# EAGLE design uClouds_SE_Main_Board (EAGLE 9.5.2)

## Sheet 1 of 5
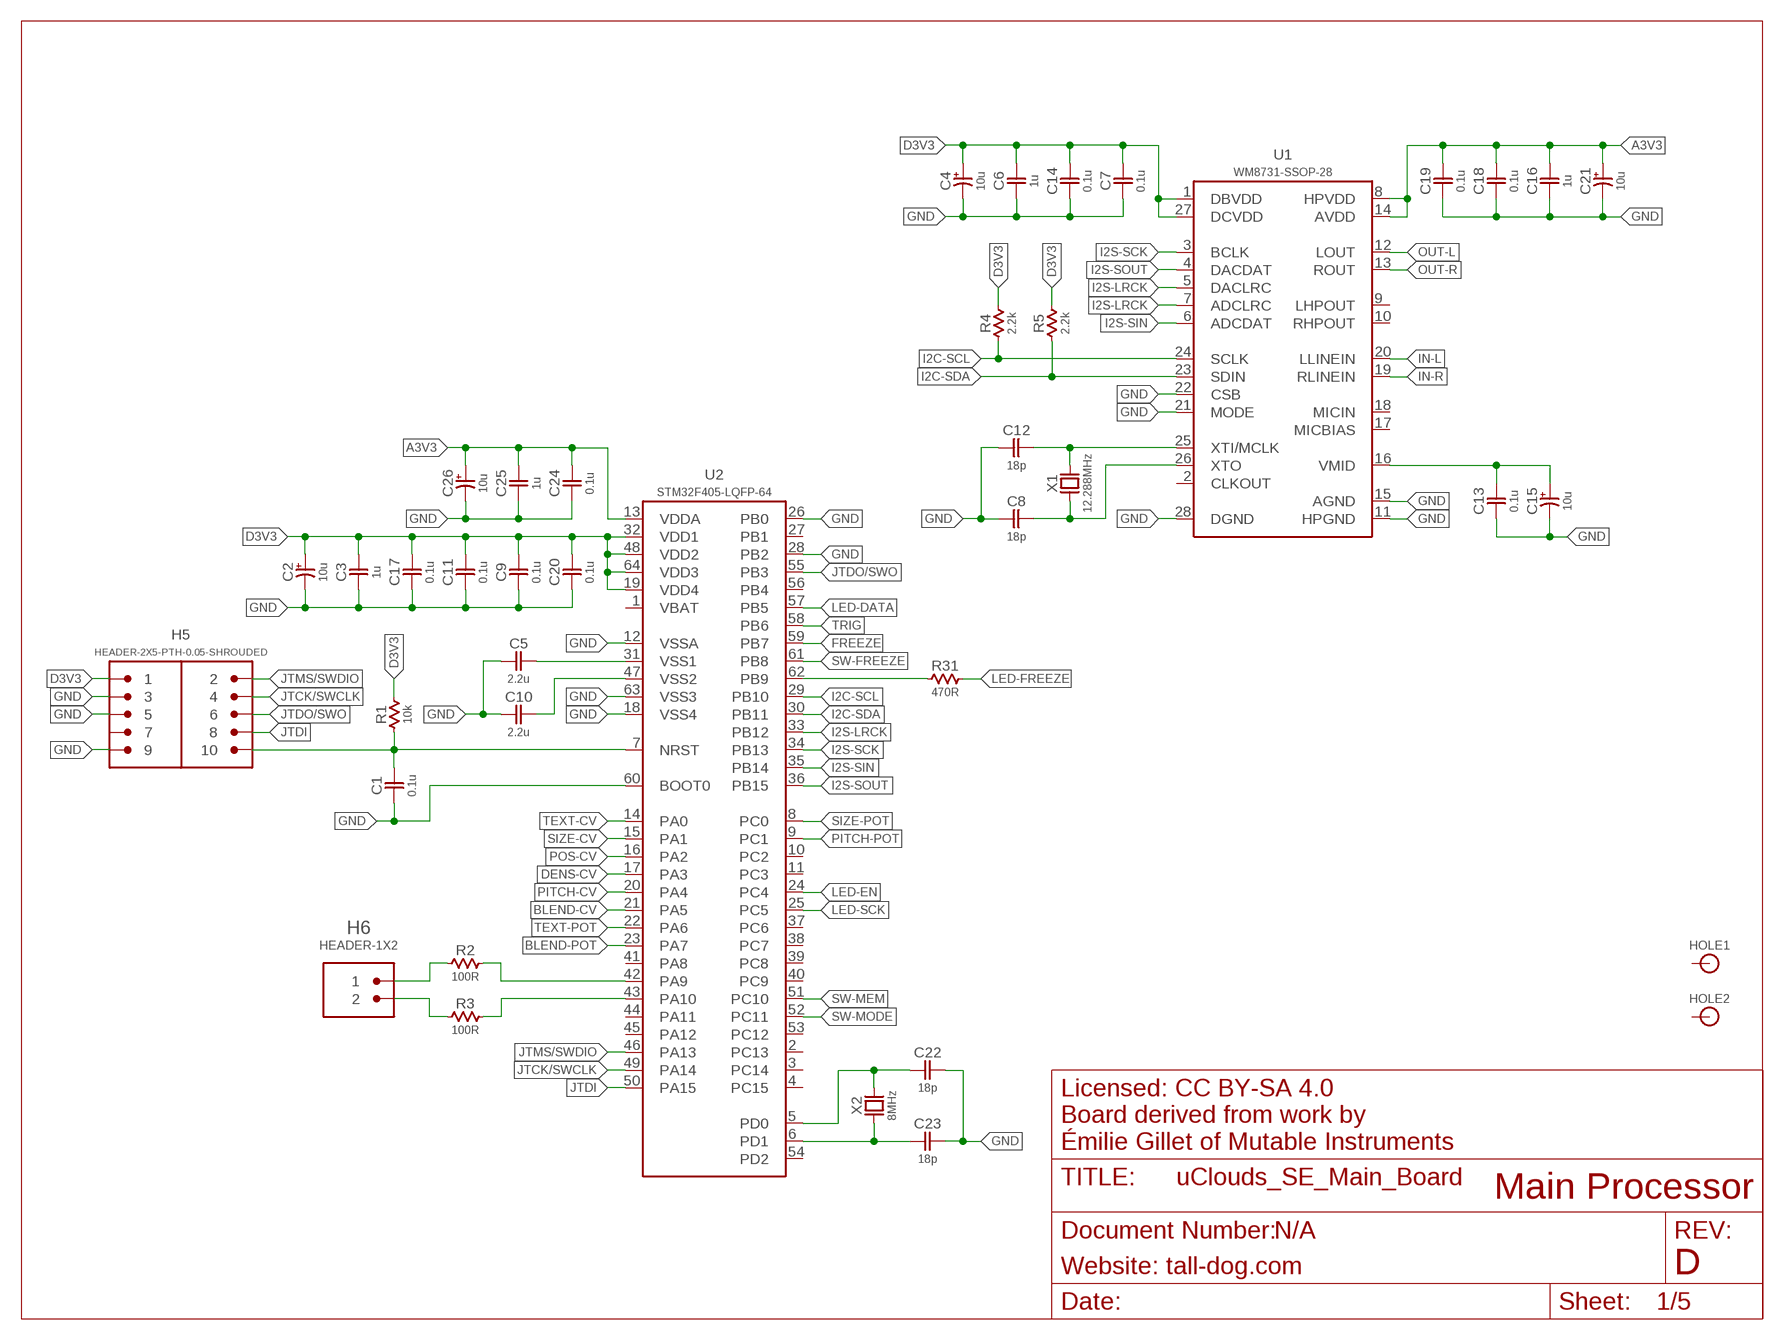
[diagram p0: schematic, sheet 1]

### Parts
C1  0.1u  CAP-NP-0603  [0603-NP]
C2  10u  CAP-P-4.3MM  [ELECTRO-SMD-4.3MM]
C3  1u  CAP-NP-0603  [0603-NP]
C4  10u  CAP-P-4.3MM  [ELECTRO-SMD-4.3MM]
C5  2.2u  CAP-NP-0603  [0603-NP]
C6  1u  CAP-NP-0603  [0603-NP]
C7  0.1u  CAP-NP-0603  [0603-NP]
C8  18p  CAP-NP-0603  [0603-NP]
C9  0.1u  CAP-NP-0603  [0603-NP]
C10  2.2u  CAP-NP-0603  [0603-NP]
C11  0.1u  CAP-NP-0603  [0603-NP]
C12  18p  CAP-NP-0603  [0603-NP]
C13  0.1u  CAP-NP-0603  [0603-NP]
C14  0.1u  CAP-NP-0603  [0603-NP]
C15  10u  CAP-P-4.3MM  [ELECTRO-SMD-4.3MM]
C16  1u  CAP-NP-0603  [0603-NP]
C17  0.1u  CAP-NP-0603  [0603-NP]
C18  0.1u  CAP-NP-0603  [0603-NP]
C19  0.1u  CAP-NP-0603  [0603-NP]
C20  0.1u  CAP-NP-0603  [0603-NP]
C21  10u  CAP-P-4.3MM  [ELECTRO-SMD-4.3MM]
C22  18p  CAP-NP-0603  [0603-NP]
C23  18p  CAP-NP-0603  [0603-NP]
C24  0.1u  CAP-NP-0603  [0603-NP]
C25  1u  CAP-NP-0603  [0603-NP]
C26  10u  CAP-P-4.3MM  [ELECTRO-SMD-4.3MM]
H5  HEADER-2X5-PTH-0.05-SHROUDED  [PTH-0.05-2X5-SHROUDED]
H6  HEADER-1X2  [PTH-0.1-1X2]
HOLE1  HOLE  [M2.5-HOLE]
HOLE2  HOLE  [M2.5-HOLE]
R1  10k  RESISTOR-0603  [0603-NP]
R2  100R  RESISTOR-0603  [0603-NP]
R3  100R  RESISTOR-0603  [0603-NP]
R4  2.2k  RESISTOR-0603  [0603-NP]
R5  2.2k  RESISTOR-0603  [0603-NP]
R31  470R  RESISTOR-0603  [0603-NP]
U1  WM8731-SSOP-28  [SSOP-28]
U2  STM32F405-LQFP-64  [LQFP-64]
X1  12.288MHz  CRYSTAL-ABM3  [CRYSTAL-ABM3]
X2  8MHz  CRYSTAL-ABM3  [CRYSTAL-ABM3]

### Nets
A3V3: C16.2 C18.2 C19.2 C21.A(POS) C24.2 C25.2 C26.A(POS) U1.8(HPVDD) U1.14(AVDD) U2.13(VDDA) ; also sheet 2,4,5
BLEND-CV: U2.21(PA5) ; also sheet 4
BLEND-POT: U2.23(PA7) ; also sheet 2
D3V3: C2.A(POS) C3.2 C4.A(POS) C6.2 C7.2 C9.2 C11.2 C14.2 C17.2 C20.2 H5.1 R1.2 R4.2 R5.2 U1.1(DBVDD) U1.27(DCVDD) U2.19(VDD4) U2.32(VDD1) U2.48(VDD2) U2.64(VDD3) ; also sheet 2,5
DENS-CV: U2.17(PA3) ; also sheet 4
FREEZE: U2.59(PB7) ; also sheet 2
GND: C1.1 C2.C(NEG) C3.1 C4.C(NEG) C5.1 C6.1 C7.1 C8.1 C9.1 C10.1 C11.1 C12.1 C13.1 C14.1 C15.C(NEG) C16.1 C17.1 C18.1 C19.1 C20.1 C21.C(NEG) C22.2 C23.2 C24.1 C25.1 C26.C(NEG) H5.3 H5.5 H5.9 U1.11(HPGND) U1.15(AGND) U1.21(MODE) U1.22(CSB) U1.28(DGND) U2.12(VSSA) U2.18(VSS4) U2.26(PB0) U2.28(PB2) U2.60(BOOT0) U2.63(VSS3) ; also sheet 2,3,4,5
I2C-SCL: R4.1 U1.24(SCLK) U2.29(PB10)
I2C-SDA: R5.1 U1.23(SDIN) U2.30(PB11)
I2S-LRCK: U1.5(DACLRC) U1.7(ADCLRC) U2.33(PB12)
I2S-SCK: U1.3(BCLK) U2.34(PB13)
I2S-SIN: U1.6(ADCDAT) U2.35(PB14)
I2S-SOUT: U1.4(DACDAT) U2.36(PB15)
IN-L: U1.20(LLINEIN) ; also sheet 3
IN-R: U1.19(RLINEIN) ; also sheet 3
JTCK/SWCLK: H5.4 U2.49(PA14)
JTDI: H5.8 U2.50(PA15)
JTDO/SWO: H5.6 U2.55(PB3)
JTMS/SWDIO: H5.2 U2.46(PA13)
LED-DATA: U2.57(PB5) ; also sheet 2
LED-EN: U2.24(PC4) ; also sheet 2
LED-FREEZE: R31.2 ; also sheet 2
LED-SCK: U2.25(PC5) ; also sheet 2
N$7: C5.2 U2.31(VSS1)
N$8: C10.2 U2.47(VSS2)
N$11: C22.1 U2.5(PD0) X2.2
N$12: C23.1 U2.6(PD1) X2.1
N$22: C12.2 U1.25(XTI/MCLK) X1.2
N$23: C8.2 U1.26(XTO) X1.1
N$27: C13.2 C15.A(POS) U1.16(VMID)
N$37: R31.1 U2.62(PB9)
OUT-L: U1.12(LOUT) ; also sheet 3
OUT-R: U1.13(ROUT) ; also sheet 3
PITCH-CV: U2.20(PA4) ; also sheet 4
PITCH-POT: U2.9(PC1) ; also sheet 2
POS-CV: U2.16(PA2) ; also sheet 4
RESET: C1.2 H5.10 R1.1 U2.7(NRST)
RX: H6.2 R3.1
RX1: R3.2 U2.43(PA10)
SIZE-CV: U2.15(PA1) ; also sheet 4
SIZE-POT: U2.8(PC0) ; also sheet 2
SW-FREEZE: U2.61(PB8) ; also sheet 2
SW-MEM: U2.51(PC10) ; also sheet 2
SW-MODE: U2.52(PC11) ; also sheet 2
TEXT-CV: U2.14(PA0) ; also sheet 4
TEXT-POT: U2.22(PA6) ; also sheet 2
TRIG: U2.58(PB6) ; also sheet 2
TX: H6.1 R2.1
TX1: R2.2 U2.42(PA9)
Unconnected: H5.7 HOLE1.P$1 HOLE1.P$2 HOLE1.P$3 HOLE1.P$4 HOLE1.P$5 HOLE1.P$6 HOLE1.P$7 HOLE1.P$8 HOLE1.P$9 HOLE2.P$1 HOLE2.P$2 HOLE2.P$3 HOLE2.P$4 HOLE2.P$5 HOLE2.P$6 HOLE2.P$7 HOLE2.P$8 HOLE2.P$9 U1.2(CLKOUT) U1.9(LHPOUT) U1.10(RHPOUT) U1.17(MICBIAS) U1.18(MICIN) U2.1(VBAT) U2.2(PC13) U2.3(PC14) U2.4(PC15) U2.10(PC2) U2.11(PC3) U2.27(PB1) U2.37(PC6) U2.38(PC7) U2.39(PC8) U2.40(PC9) U2.41(PA8) U2.44(PA11) U2.45(PA12) U2.53(PC12) U2.54(PD2) U2.56(PB4)

### Notes on the sheet
- Licensed: CC BY-SA 4.0
  Board derived from work by
  Émilie Gillet of Mutable Instruments
- Main Processor
- N/A
- Website: tall-dog.com | D

## Sheet 2 of 5
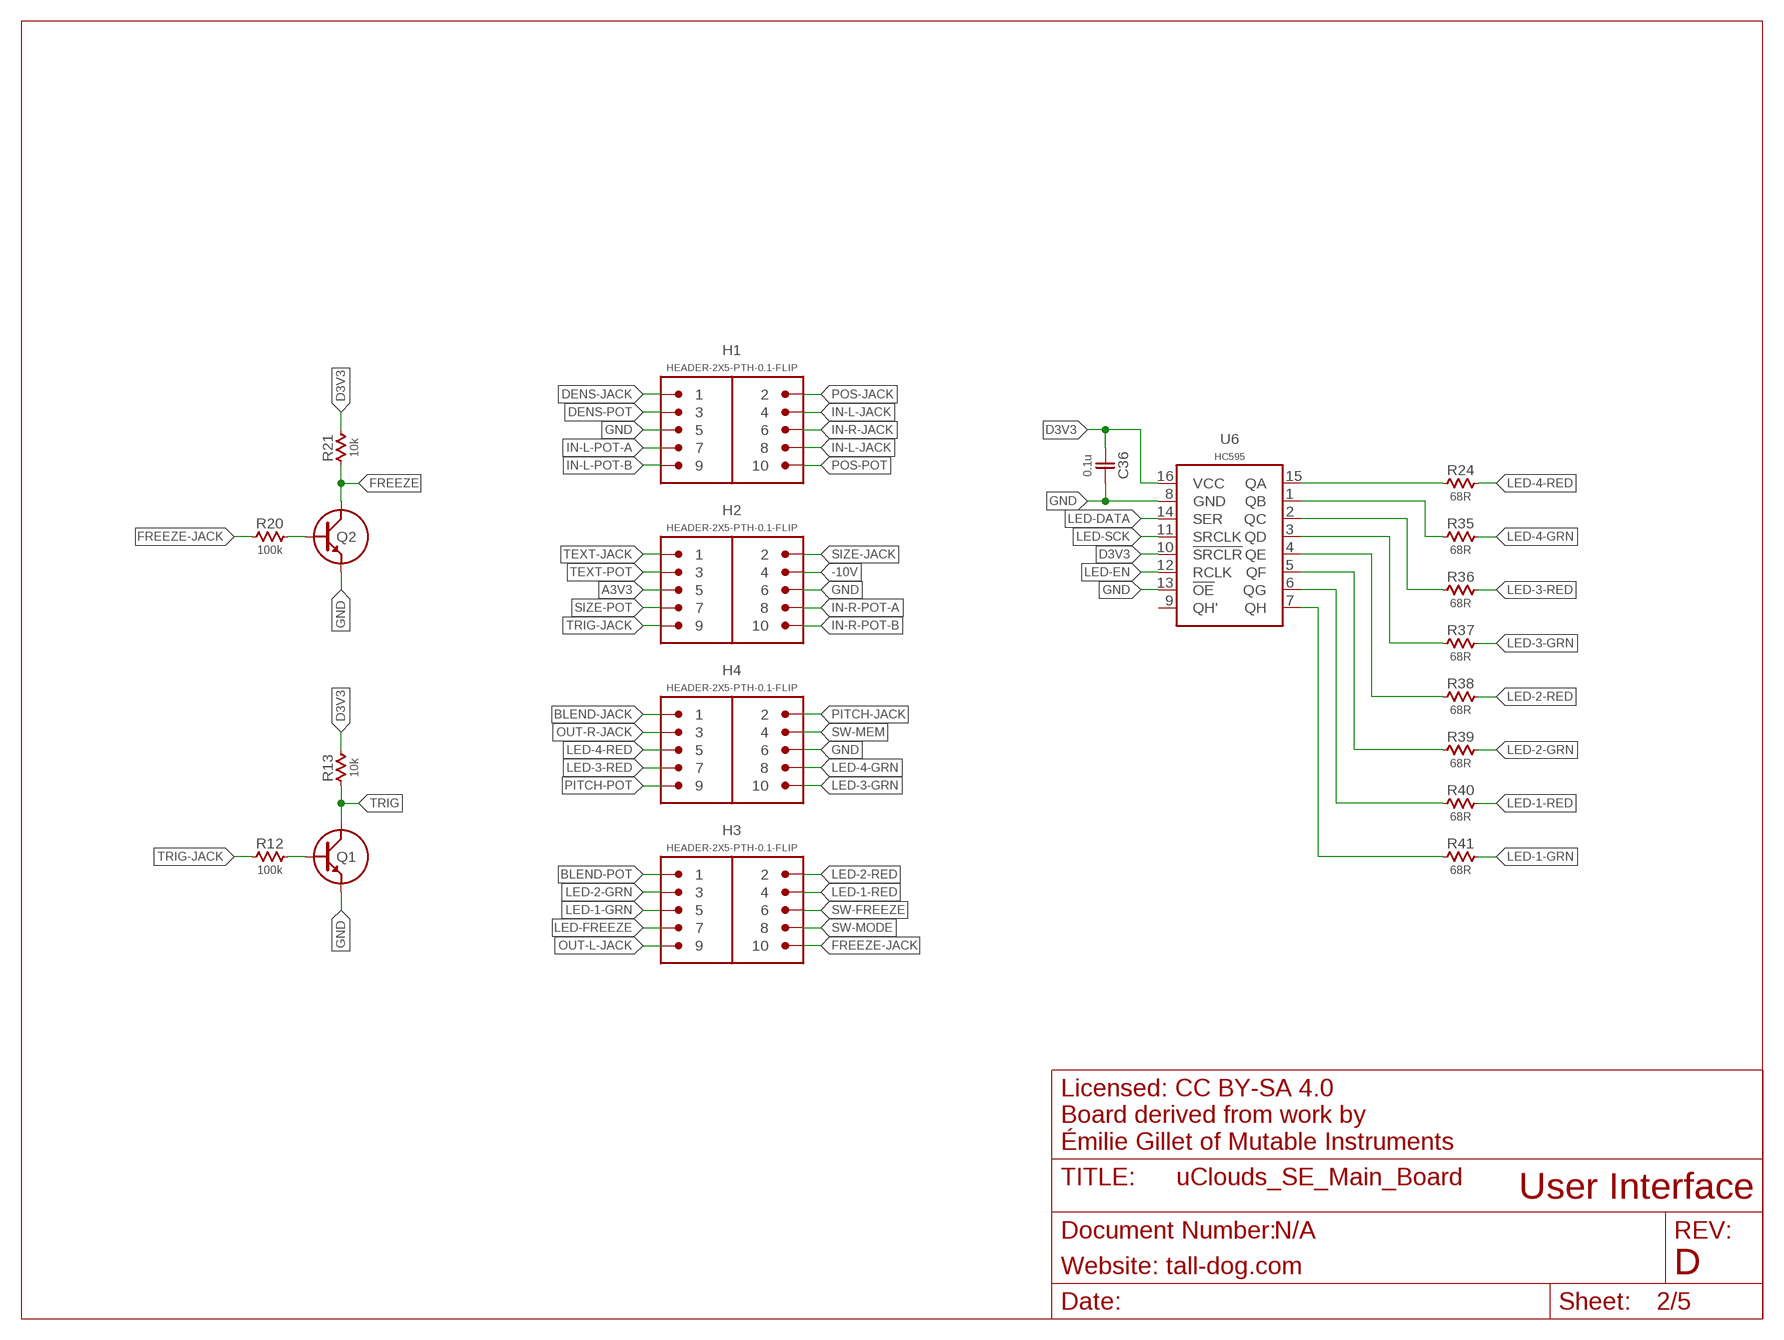
[diagram p1: schematic, sheet 2]

### Parts
C36  0.1u  CAP-NP-0603  [0603-NP]
H1  HEADER-2X5-PTH-0.1-FLIP  [PTH-0.1-2X5-FEMALE]
H2  HEADER-2X5-PTH-0.1-FLIP  [PTH-0.1-2X5-FEMALE]
H3  HEADER-2X5-PTH-0.1-FLIP  [PTH-0.1-2X5-FEMALE]
H4  HEADER-2X5-PTH-0.1-FLIP  [PTH-0.1-2X5-FEMALE]
Q1  NPN-SOT23-BEC  [SOT-23]
Q2  NPN-SOT23-BEC  [SOT-23]
R12  100k  RESISTOR-0603  [0603-NP]
R13  10k  RESISTOR-0603  [0603-NP]
R20  100k  RESISTOR-0603  [0603-NP]
R21  10k  RESISTOR-0603  [0603-NP]
R24  68R  RESISTOR-0603  [0603-NP]
R35  68R  RESISTOR-0603  [0603-NP]
R36  68R  RESISTOR-0603  [0603-NP]
R37  68R  RESISTOR-0603  [0603-NP]
R38  68R  RESISTOR-0603  [0603-NP]
R39  68R  RESISTOR-0603  [0603-NP]
R40  68R  RESISTOR-0603  [0603-NP]
R41  68R  RESISTOR-0603  [0603-NP]
U6  HC595  [TSSOP-16]

### Nets
-10V: H2.4 ; also sheet 4,5
A3V3: H2.5 ; also sheet 1,4,5
BLEND-JACK: H4.1 ; also sheet 4
BLEND-POT: H3.1 ; also sheet 1
D3V3: C36.2 R13.2 R21.2 U6.10(!SRCLR) U6.16(VCC) ; also sheet 1,5
DENS-JACK: H1.1 ; also sheet 4
DENS-POT: H1.3 ; also sheet 4
FREEZE: Q2.3(C) R21.1 ; also sheet 1
FREEZE-JACK: H3.10 R20.1
GND: C36.1 H1.5 H2.6 H4.6 Q1.2(E) Q2.2(E) U6.8(GND) U6.13(!OE) ; also sheet 1,3,4,5
IN-L-JACK: H1.4 H1.8 ; also sheet 3
IN-L-POT-A: H1.7 ; also sheet 3
IN-L-POT-B: H1.9 ; also sheet 3
IN-R-JACK: H1.6 ; also sheet 3
IN-R-POT-A: H2.8 ; also sheet 3
IN-R-POT-B: H2.10 ; also sheet 3
LED-1-GRN: H3.5 R41.2
LED-1-RED: H3.4 R40.2
LED-2-GRN: H3.3 R39.2
LED-2-RED: H3.2 R38.2
LED-3-GRN: H4.10 R37.2
LED-3-RED: H4.7 R36.2
LED-4-GRN: H4.8 R35.2
LED-4-RED: H4.5 R24.2
LED-DATA: U6.14(SER) ; also sheet 1
LED-EN: U6.12(RCLK) ; also sheet 1
LED-FREEZE: H3.7 ; also sheet 1
LED-SCK: U6.11(SRCLK) ; also sheet 1
N$1: R24.1 U6.15(QA)
N$6: R35.1 U6.1(QB)
N$9: R36.1 U6.2(QC)
N$10: Q1.1(B) R12.2
N$21: Q2.1(B) R20.2
N$28: R37.1 U6.3(QD)
N$30: R38.1 U6.4(QE)
N$31: R39.1 U6.5(QF)
N$32: R40.1 U6.6(QG)
N$33: R41.1 U6.7(QH)
OUT-L-JACK: H3.9 ; also sheet 3
OUT-R-JACK: H4.3 ; also sheet 3
PITCH-JACK: H4.2 ; also sheet 4
PITCH-POT: H4.9 ; also sheet 1
POS-JACK: H1.2 ; also sheet 4
POS-POT: H1.10 ; also sheet 4
SIZE-JACK: H2.2 ; also sheet 4
SIZE-POT: H2.7 ; also sheet 1
SW-FREEZE: H3.6 ; also sheet 1
SW-MEM: H4.4 ; also sheet 1
SW-MODE: H3.8 ; also sheet 1
TEXT-JACK: H2.1 ; also sheet 4
TEXT-POT: H2.3 ; also sheet 1
TRIG: Q1.3(C) R13.1 ; also sheet 1
TRIG-JACK: H2.9 R12.1
Unconnected: U6.9(QH')

### Notes on the sheet
- Licensed: CC BY-SA 4.0
  Board derived from work by
  Émilie Gillet of Mutable Instruments
- User Interface
- N/A
- Website: tall-dog.com | D

## Sheet 3 of 5
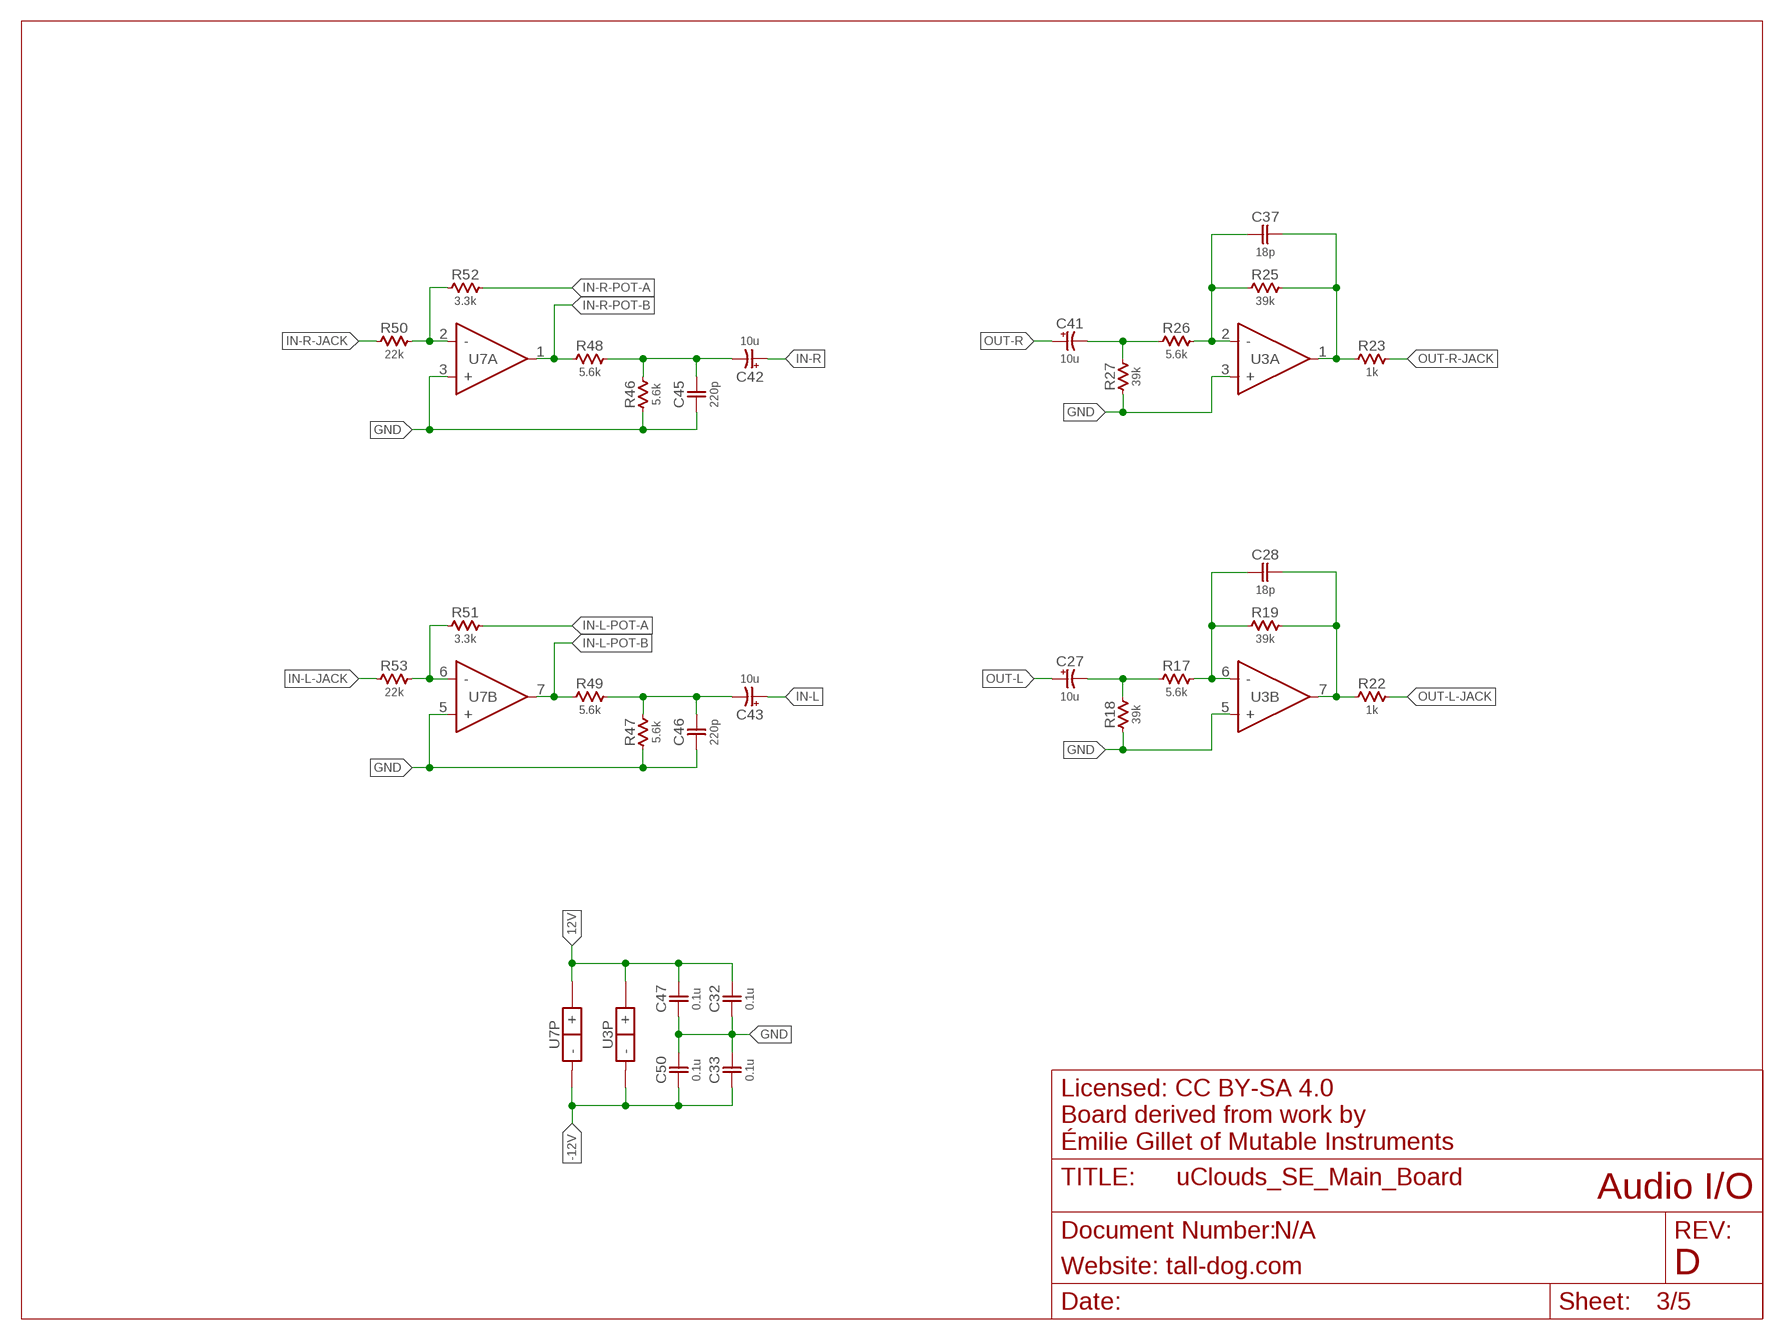
[diagram p2: schematic, sheet 3]

### Parts
C27  10u  CAP-P-4.3MM  [ELECTRO-SMD-4.3MM]
C28  18p  CAP-NP-0603  [0603-NP]
C32  0.1u  CAP-NP-0603  [0603-NP]
C33  0.1u  CAP-NP-0603  [0603-NP]
C37  18p  CAP-NP-0603  [0603-NP]
C41  10u  CAP-P-4.3MM  [ELECTRO-SMD-4.3MM]
C42  10u  CAP-P-4.3MM  [ELECTRO-SMD-4.3MM]
C43  10u  CAP-P-4.3MM  [ELECTRO-SMD-4.3MM]
C45  220p  CAP-NP-0603  [0603-NP]
C46  220p  CAP-NP-0603  [0603-NP]
C47  0.1u  CAP-NP-0603  [0603-NP]
C50  0.1u  CAP-NP-0603  [0603-NP]
R17  5.6k  RESISTOR-0603  [0603-NP]
R18  39k  RESISTOR-0603  [0603-NP]
R19  39k  RESISTOR-0603  [0603-NP]
R22  1k  RESISTOR-0603  [0603-NP]
R23  1k  RESISTOR-0603  [0603-NP]
R25  39k  RESISTOR-0603  [0603-NP]
R26  5.6k  RESISTOR-0603  [0603-NP]
R27  39k  RESISTOR-0603  [0603-NP]
R46  5.6k  RESISTOR-0603  [0603-NP]
R47  5.6k  RESISTOR-0603  [0603-NP]
R48  5.6k  RESISTOR-0603  [0603-NP]
R49  5.6k  RESISTOR-0603  [0603-NP]
R50  22k  RESISTOR-0603  [0603-NP]
R51  3.3k  RESISTOR-0603  [0603-NP]
R52  3.3k  RESISTOR-0603  [0603-NP]
R53  22k  RESISTOR-0603  [0603-NP]
U3  TL072-TSSOP-8  [TSSOP-8]
U7  TL072-TSSOP-8  [TSSOP-8]

### Nets
12V: C32.2 C47.2 U3.8(P:+) U7.8(P:+) ; also sheet 5
-12V: C33.1 C50.1 U3.4(P:-) U7.4(P:-) ; also sheet 5
GND: C32.1 C33.2 C45.1 C46.1 C47.1 C50.2 R18.1 R27.1 R46.1 R47.1 U3.3(A:+) U3.5(B:+) U7.3(A:+) U7.5(B:+) ; also sheet 1,2,4,5
IN-L: C43.A(POS) ; also sheet 1
IN-L-JACK: R53.1 ; also sheet 2
IN-L-POT-A: R51.2 ; also sheet 2
IN-L-POT-B: R49.1 U7.7(B:OUT) ; also sheet 2
IN-R: C42.A(POS) ; also sheet 1
IN-R-JACK: R50.1 ; also sheet 2
IN-R-POT-A: R52.2 ; also sheet 2
IN-R-POT-B: R48.1 U7.1(A:OUT) ; also sheet 2
N$3: R50.2 R52.1 U7.2(A:-)
N$4: R51.1 R53.2 U7.6(B:-)
N$18: C27.C(NEG) R17.1 R18.2
N$19: C43.C(NEG) C46.2 R47.2 R49.2
N$20: C41.C(NEG) R26.1 R27.2
N$24: C28.1 R17.2 R19.1 U3.6(B:-)
N$25: C28.2 R19.2 R22.1 U3.7(B:OUT)
N$26: C37.1 R25.1 R26.2 U3.2(A:-)
N$29: C37.2 R23.1 R25.2 U3.1(A:OUT)
N$35: C42.C(NEG) C45.2 R46.2 R48.2
OUT-L: C27.A(POS) ; also sheet 1
OUT-L-JACK: R22.2 ; also sheet 2
OUT-R: C41.A(POS) ; also sheet 1
OUT-R-JACK: R23.2 ; also sheet 2

### Notes on the sheet
- Licensed: CC BY-SA 4.0
  Board derived from work by
  Émilie Gillet of Mutable Instruments
- Audio I/O
- N/A
- Website: tall-dog.com | D

## Sheet 4 of 5
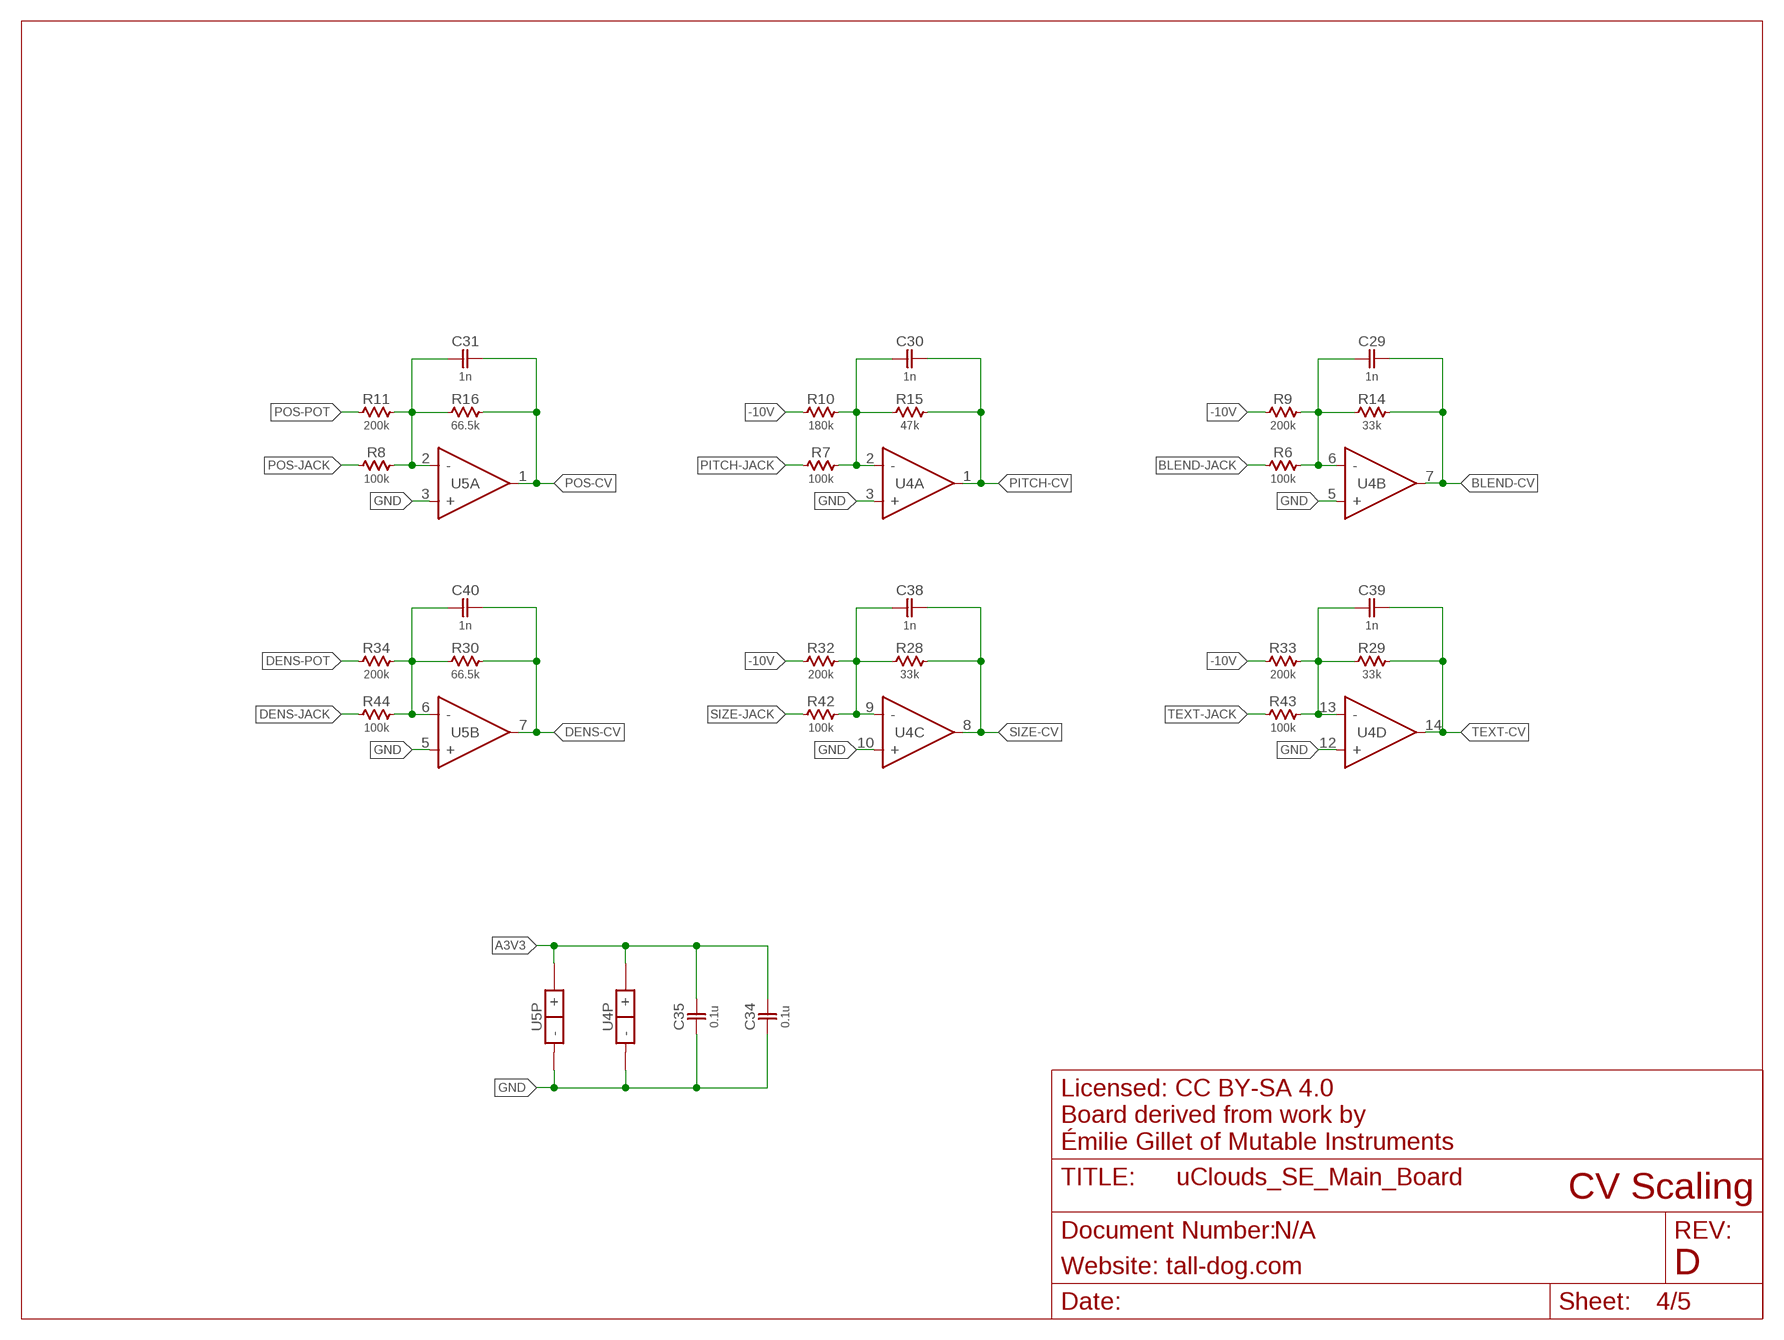
[diagram p3: schematic, sheet 4]

### Parts
C29  1n  CAP-NP-0603  [0603-NP]
C30  1n  CAP-NP-0603  [0603-NP]
C31  1n  CAP-NP-0603  [0603-NP]
C34  0.1u  CAP-NP-0603  [0603-NP]
C35  0.1u  CAP-NP-0603  [0603-NP]
C38  1n  CAP-NP-0603  [0603-NP]
C39  1n  CAP-NP-0603  [0603-NP]
C40  1n  CAP-NP-0603  [0603-NP]
R6  100k  RESISTOR-0603  [0603-NP]
R7  100k  RESISTOR-0603  [0603-NP]
R8  100k  RESISTOR-0603  [0603-NP]
R9  200k  RESISTOR-0603  [0603-NP]
R10  180k  RESISTOR-0603  [0603-NP]
R11  200k  RESISTOR-0603  [0603-NP]
R14  33k  RESISTOR-0603  [0603-NP]
R15  47k  RESISTOR-0603  [0603-NP]
R16  66.5k  RESISTOR-0603  [0603-NP]
R28  33k  RESISTOR-0603  [0603-NP]
R29  33k  RESISTOR-0603  [0603-NP]
R30  66.5k  RESISTOR-0603  [0603-NP]
R32  200k  RESISTOR-0603  [0603-NP]
R33  200k  RESISTOR-0603  [0603-NP]
R34  200k  RESISTOR-0603  [0603-NP]
R42  100k  RESISTOR-0603  [0603-NP]
R43  100k  RESISTOR-0603  [0603-NP]
R44  100k  RESISTOR-0603  [0603-NP]
U4  MCP6004-TSSOP-14  [TSSOP-14]
U5  MCP6002-MSOP-8  [MSOP-8]

### Nets
-10V: R9.1 R10.1 R32.1 R33.1 ; also sheet 2,5
A3V3: C34.2 C35.2 U4.4(P:+) U5.8(P:+) ; also sheet 1,2,5
BLEND-CV: C29.2 R14.2 U4.7(B:OUT) ; also sheet 1
BLEND-JACK: R6.1 ; also sheet 2
DENS-CV: C40.2 R30.2 U5.7(B:OUT) ; also sheet 1
DENS-JACK: R44.1 ; also sheet 2
DENS-POT: R34.1 ; also sheet 2
GND: C34.1 C35.1 U4.3(A:+) U4.5(B:+) U4.10(C:+) U4.11(P:-) U4.12(D:+) U5.3(A:+) U5.4(P:-) U5.5(B:+) ; also sheet 1,2,3,5
N$5: C29.1 R6.2 R9.2 R14.1 U4.6(B:-)
N$13: C31.1 R8.2 R11.2 R16.1 U5.2(A:-)
N$14: C40.1 R30.1 R34.2 R44.2 U5.6(B:-)
N$15: C38.1 R28.1 R32.2 R42.2 U4.9(C:-)
N$16: C30.1 R7.2 R10.2 R15.1 U4.2(A:-)
N$17: C39.1 R29.1 R33.2 R43.2 U4.13(D:-)
PITCH-CV: C30.2 R15.2 U4.1(A:OUT) ; also sheet 1
PITCH-JACK: R7.1 ; also sheet 2
POS-CV: C31.2 R16.2 U5.1(A:OUT) ; also sheet 1
POS-JACK: R8.1 ; also sheet 2
POS-POT: R11.1 ; also sheet 2
SIZE-CV: C38.2 R28.2 U4.8(C:OUT) ; also sheet 1
SIZE-JACK: R42.1 ; also sheet 2
TEXT-CV: C39.2 R29.2 U4.14(D:OUT) ; also sheet 1
TEXT-JACK: R43.1 ; also sheet 2

### Notes on the sheet
- Licensed: CC BY-SA 4.0
  Board derived from work by
  Émilie Gillet of Mutable Instruments
- CV Scaling
- N/A
- Website: tall-dog.com | D

## Sheet 5 of 5
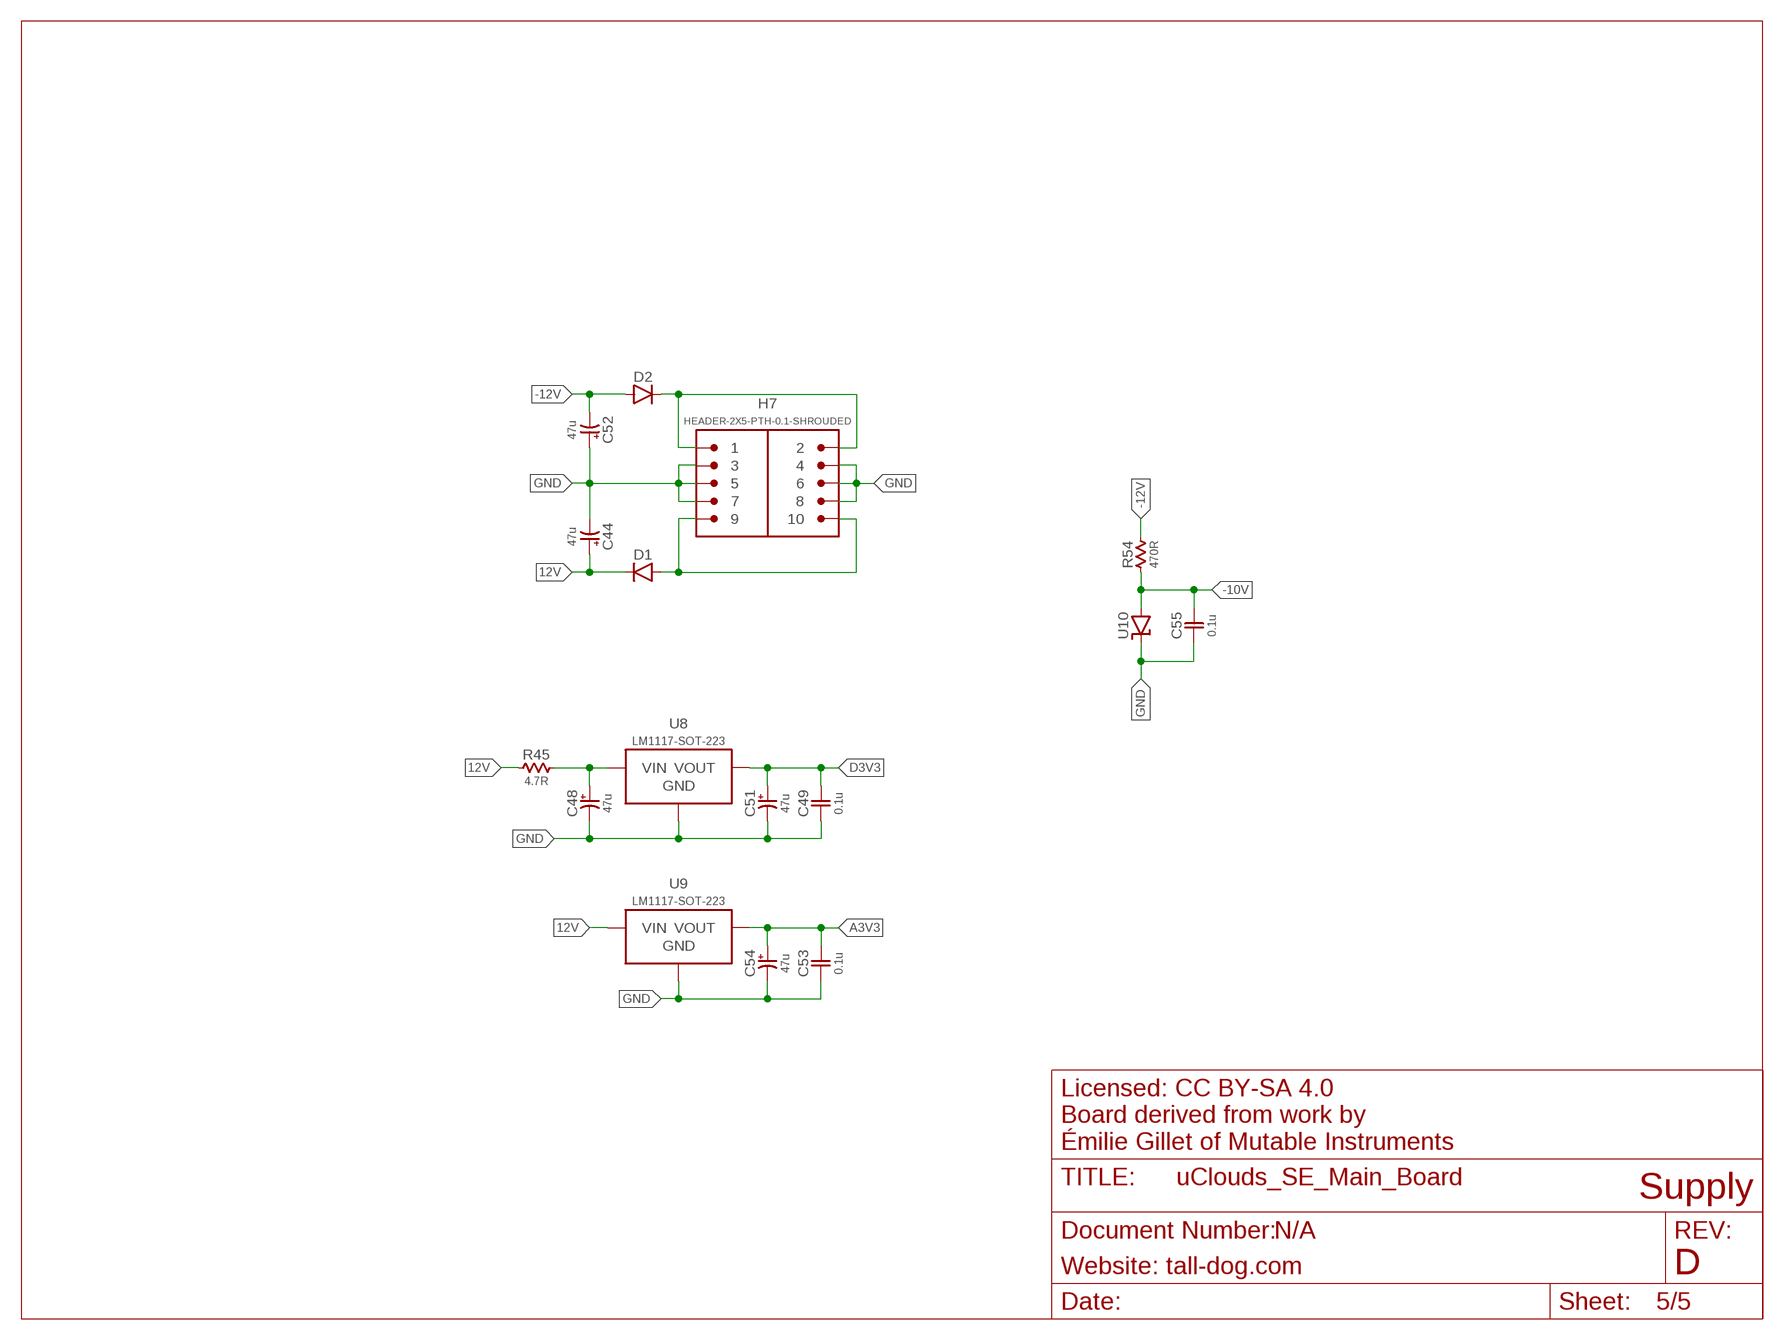
[diagram p4: schematic, sheet 5]

### Parts
C44  47u  CAP-P-6.6MM  [ELECTRO-SMD-6.6MM]
C48  47u  CAP-P-6.6MM  [ELECTRO-SMD-6.6MM]
C49  0.1u  CAP-NP-0603  [0603-NP]
C51  47u  CAP-P-6.6MM  [ELECTRO-SMD-6.6MM]
C52  47u  CAP-P-6.6MM  [ELECTRO-SMD-6.6MM]
C53  0.1u  CAP-NP-0603  [0603-NP]
C54  47u  CAP-P-6.6MM  [ELECTRO-SMD-6.6MM]
C55  0.1u  CAP-NP-0603  [0603-NP]
D1  DIODE-SOD123  [SOD-123]
D2  DIODE-SOD123  [SOD-123]
H7  HEADER-2X5-PTH-0.1-SHROUDED  [PTH-0.1-2X5-SHROUDED]
R45  4.7R  RESISTOR-1206  [1206-NP]
R54  470R  RESISTOR-0603  [0603-NP]
U8  LM1117-SOT-223  [SOT-223]
U9  LM1117-SOT-223  [SOT-223]
U10  ZENER-SOT-23  [SOT-23]

### Nets
12V: C44.A(POS) D1.C R45.1 U9.3(VIN) ; also sheet 3
-10V: C55.2 R54.1 U10.2(A) ; also sheet 2,4
-12V: C52.C(NEG) D2.A R54.2 ; also sheet 3
A3V3: C53.2 C54.A(POS) U9.2(VOUT) U9.4(VOUT) ; also sheet 1,2,4
D3V3: C49.2 C51.A(POS) U8.2(VOUT) U8.4(VOUT) ; also sheet 1,2
GND: C44.C(NEG) C48.C(NEG) C49.1 C51.C(NEG) C52.A(POS) C53.1 C54.C(NEG) C55.1 H7.3 H7.4 H7.5 H7.6 H7.7 H7.8 U8.1(GND) U9.1(GND) U10.1(C) ; also sheet 1,2,3,4
N$2: C48.A(POS) R45.2 U8.3(VIN)
N$100: D2.C H7.1 H7.2
N$101: D1.A H7.9 H7.10

### Notes on the sheet
- Licensed: CC BY-SA 4.0
  Board derived from work by
  Émilie Gillet of Mutable Instruments
- Supply
- N/A
- Website: tall-dog.com | D

## Library data of the parts
C1 C3 C5-C14 C16-C20 C22-C25 C28-C40 C45-C47 C49 C50 C53 C55 = uClouds_SE_Library:CAP-NP
C2 C4 C15 C21 C26 C27 C41-C44 C48 C51 C52 C54 = uClouds_SE_Library:CAP-P
D1 D2 = uClouds_SE_Library:DIODE
H1-H5 H7 = uClouds_SE_Library:HEADER-2X5
H6 = uClouds_SE_Library:HEADER-1X2
HOLE1 HOLE2 = uClouds_SE_Library:HOLE
Q1 Q2 = uClouds_SE_Library:NPN
R1-R54 = uClouds_SE_Library:RESISTOR
U1 = uClouds_SE_Library:WM8731
U2 = uClouds_SE_Library:STM32F405
U3 U7 = uClouds_SE_Library:TL072: OP AMP
U4 = uClouds_SE_Library:MCP6004
U5 = uClouds_SE_Library:MCP6002
U6 = uClouds_SE_Library:HC595
U8 U9 = uClouds_SE_Library:LM1117: 800mA and 1A Low Dropout (LDO) Positive Regulator 1.8V, 2.5V, 2.85V, 3.3V, 5V, and Adj
U10 = uClouds_SE_Library:ZENER: PRECISION MICROPOWER SHUNT VOLTAGE REFERENCE Source: http://focus.ti.com/lit/ds/slcs146e/slcs146e.pdf
X1 X2 = uClouds_SE_Library:CRYSTAL

## Board
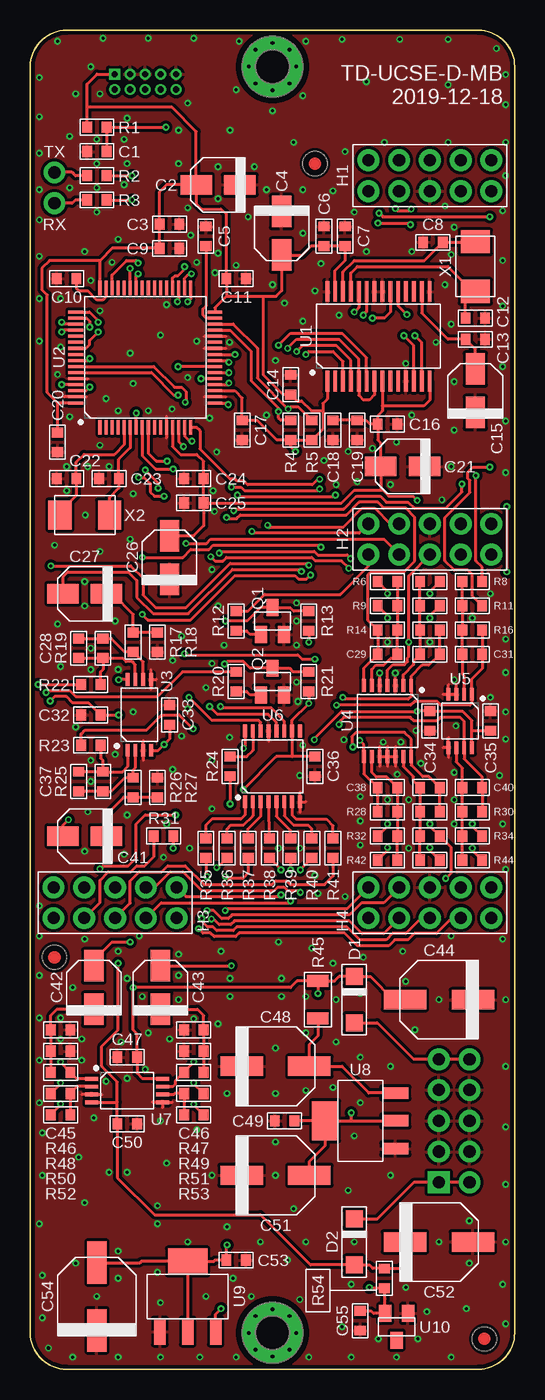
[diagram p5: board, top side]
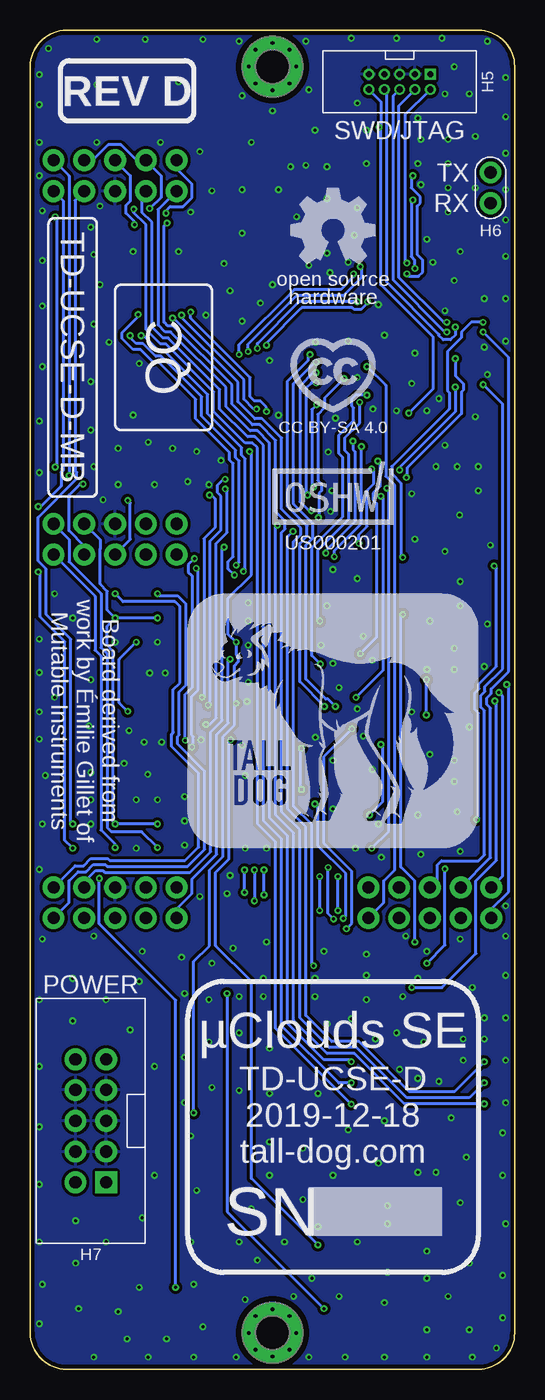
[diagram p6: board, bottom side, seen from below]

Size 40 x 110.5 mm. Coordinates in mm from the lower left corner, seen from the top.
Outline: 3,0 37,0 arc90 40,3 40,107.5 arc90 37,110.5 3,110.5 arc90 0,107.5 0,3 arc90 3,0
Copper layers (1*16): Top 0.035mm / dielectric 1.5mm / Bottom 0.035mm
Design rules "brds *": minimum track width 0.25mm, minimum drill 0.25mm, track to track 8mil, track to pad 8mil, pad to pad 8mil, via to via 8mil, smd to smd 0mil, copper to edge 12mil, drill to drill 8mil, minimum pad ring 6mil, minimum via ring 6mil, stop-mask expansion 0mil, vias tented up to drill 0.3mm, thermal gap 10mil

### Footprints (pad centres in the part's own frame; a part is rotated, then mirrored left to right if it is on the bottom)
0603-NP = smd 0.81 x 0.93: 1 -0.81,0; 2 0.81,0
ELECTRO-SMD-4.3MM = smd 2.6 x 1.6: A 1.8,0; C -1.8,0
ELECTRO-SMD-6.6MM = smd 3.5 x 1.6: A 2.8,0; C -2.8,0
SOD-123 = smd 1.4 x 1.4: A 1.9,0; C -1.9,0
PTH-0.1-2X5-FEMALE = drill 1 pad 1.8: 1 -5.08,-1.27; 2 -5.08,1.27; 3 -2.54,-1.27; 4 -2.54,1.27; 5 0,-1.27; 6 0,1.27; 7 2.54,-1.27; 8 2.54,1.27; 9 5.08,-1.27; 10 5.08,1.27
PTH-0.05-2X5-SHROUDED = drill 0.5 pad 0.9 square: 1 -0.635,2.54 | drill 0.5 pad 0.9: 2 0.635,2.54; 3 -0.635,1.27; 4 0.635,1.27; 5 -0.635,0; 6 0.635,0; 7 -0.635,-1.27; 8 0.635,-1.27; 9 -0.635,-2.54; 10 0.635,-2.54
PTH-0.1-1X2 = drill 1.016 pad 1.778: 1 -1.27,0; 2 1.27,0
PTH-0.1-2X5-SHROUDED = drill 1 pad 1.8 square: 1 -1.27,5.08 | drill 1 pad 1.8: 2 1.27,5.08; 3 -1.27,2.54; 4 1.27,2.54; 5 -1.27,0; 6 1.27,0; 7 -1.27,-2.54; 8 1.27,-2.54; 9 -1.27,-5.08; 10 1.27,-5.08
M2.5-HOLE = drill 2.75 pad 5: P$1 0,0 | drill 0.3: P$2 0,1.95; P$3 0,-1.95; P$4 -1.95,0; P$5 1.95,0; P$6 1.4,1.4; P$7 -1.4,1.4; P$8 -1.4,-1.4; P$9 1.4,-1.4
SOT-23 = smd 1 x 1.4: 1 -0.95,-1.1; 2 0.95,-1.1; 3 0,1.1
1206-NP = smd 1 x 1.77: 1 -1.535,0; 2 1.535,0
SSOP-28 = smd 0.32 x 1.7: 1 -4.225,-3.7; 2 -3.575,-3.7; 3 -2.925,-3.7; 4 -2.275,-3.7; 5 -1.625,-3.7; 6 -0.975,-3.7; 7 -0.325,-3.7; 8 0.325,-3.7; 9 0.975,-3.7; 10 1.625,-3.7; 11 2.275,-3.7; 12 2.925,-3.7; 13 3.575,-3.7; 14 4.225,-3.7; 15 4.225,3.7; 16 3.575,3.7; 17 2.925,3.7; 18 2.275,3.7; 19 1.625,3.7; 20 0.975,3.7; 21 0.325,3.7; 22 -0.325,3.7; 23 -0.975,3.7; 24 -1.625,3.7; 25 -2.275,3.7; 26 -2.925,3.7; 27 -3.575,3.7; 28 -4.225,3.7
LQFP-64 = smd 0.25 x 1.2: 1 -3.75,-5.75; 2 -3.25,-5.75; 3 -2.75,-5.75; 4 -2.25,-5.75; 5 -1.75,-5.75; 6 -1.25,-5.75; 7 -0.75,-5.75; 8 -0.25,-5.75; 9 0.25,-5.75; 10 0.75,-5.75; 11 1.25,-5.75; 12 1.75,-5.75; 13 2.25,-5.75; 14 2.75,-5.75; 15 3.25,-5.75; 16 3.75,-5.75; 33 3.75,5.75; 34 3.25,5.75; 35 2.75,5.75; 36 2.25,5.75; 37 1.75,5.75; 38 1.25,5.75; 39 0.75,5.75; 40 0.25,5.75; 41 -0.25,5.75; 42 -0.75,5.75; 43 -1.25,5.75; 44 -1.75,5.75; 45 -2.25,5.75; 46 -2.75,5.75; 47 -3.25,5.75; 48 -3.75,5.75 | smd 1.2 x 0.25: 17 5.75,-3.75; 18 5.75,-3.25; 19 5.75,-2.75; 20 5.75,-2.25; 21 5.75,-1.75; 22 5.75,-1.25; 23 5.75,-0.75; 24 5.75,-0.25; 25 5.75,0.25; 26 5.75,0.75; 27 5.75,1.25; 28 5.75,1.75; 29 5.75,2.25; 30 5.75,2.75; 31 5.75,3.25; 32 5.75,3.75; 49 -5.75,3.75; 50 -5.75,3.25; 51 -5.75,2.75; 52 -5.75,2.25; 53 -5.75,1.75; 54 -5.75,1.25; 55 -5.75,0.75; 56 -5.75,0.25; 57 -5.75,-0.25; 58 -5.75,-0.75; 59 -5.75,-1.25; 60 -5.75,-1.75; 61 -5.75,-2.25; 62 -5.75,-2.75; 63 -5.75,-3.25; 64 -5.75,-3.75
TSSOP-8 = smd 0.32 x 1.05: 1 -0.975,-2.925; 2 -0.325,-2.925; 3 0.325,-2.925; 4 0.975,-2.925; 5 0.975,2.925; 6 0.325,2.925; 7 -0.325,2.925; 8 -0.975,2.925
TSSOP-14 = smd 0.32 x 1.05: 1 -1.95,-2.925; 2 -1.3,-2.925; 3 -0.65,-2.925; 4 0,-2.925; 5 0.65,-2.925; 6 1.3,-2.925; 7 1.95,-2.925; 8 1.95,2.925; 9 1.3,2.925; 10 0.65,2.925; 11 0,2.925; 12 -0.65,2.925; 13 -1.3,2.925; 14 -1.95,2.925
MSOP-8 = smd 0.32 x 1.05: 1 -0.975,-2.2; 2 -0.325,-2.2; 3 0.325,-2.2; 4 0.975,-2.2; 5 0.975,2.2; 6 0.325,2.2; 7 -0.325,2.2; 8 -0.975,2.2
TSSOP-16 = smd 0.32 x 1.05: 1 -2.275,-2.925; 2 -1.625,-2.925; 3 -0.975,-2.925; 4 -0.325,-2.925; 5 0.325,-2.925; 6 0.975,-2.925; 7 1.625,-2.925; 8 2.275,-2.925; 9 2.275,2.925; 10 1.625,2.925; 11 0.975,2.925; 12 0.325,2.925; 13 -0.325,2.925; 14 -0.975,2.925; 15 -1.625,2.925; 16 -2.275,2.925
SOT-223 = smd 0.95 x 2.15: 1 -2.3,-2.9; 2 0,-2.9; 3 2.3,-2.9 | smd 3.25 x 2.15: 4 0,2.9
CRYSTAL-ABM3 = smd 1.9 x 2.4: 1 -2.05,0; 2 2.05,0

### Placement (x,y rotation side)
C1  5.5,100.5 0 top
C2  15.5,97.75 180 top
C3  11.5,94.5 180 top
C4  20.75,93.75 270 top
C5  14.5,93.5 270 top
C6  24.25,93.5 270 top
C7  26,93.5 270 top
C8  33.25,93 0 top
C9  11.5,92.5 180 top
C10  3,90 0 top
C11  17,90 180 top
C12  36.75,86.75 180 top
C13  36.75,85 180 top
C14  21.5,81.25 270 top
C15  36.75,80.75 90 top
C16  29.5,78 180 top
C17  17.5,77.5 90 top
C18  25,77.5 90 top
C19  27,77.5 90 top
C20  2.25,76.5 90 top
C21  30.75,74.5 180 top
C22  3,73.5 180 top
C23  6.5,73.5 180 top
C24  13.5,73.5 0 top
C25  13.5,71.5 0 top
C26  11.5,67 90 top
C27  4.5,64 180 top
C28  4,59.5 270 top
C29  29.5,59 180 top
C30  33,59 0 top
C31  36.5,59 0 top
C32  5,54 0 top
C33  11.5,54 90 top
C34  33,53.5 90 top
C35  38,53.5 270 top
C36  23.5,49.75 90 top
C37  4,48.5 90 top
C38  29.5,48 180 top
C39  33,48 0 top
C40  36.5,48 0 top
C41  4.5,44 180 top
C42  5.25,31.5 90 top
C43  10.75,31.5 90 top
C44  33.75,30.5 180 top
C45  2.5,28 180 top
C46  13.5,28 0 top
C47  8,25.75 0 top
C48  20.25,25 0 top
C49  21,20.5 0 top
C50  8,20.25 0 top
C51  20.25,16 0 top
C52  33.75,10.5 0 top
C53  17,9 180 top
C54  5.5,6 90 top
C55  27.25,4 90 top
D1  26.75,30.5 270 top
D2  26.75,10.5 270 top
H1  33,98.5 0 bottom
H2  33,68.5 0 bottom
H3  7,38.5 0 bottom
H4  33,38.5 0 bottom
H5  9.5,106.25 270 bottom
H6  2,97.5 270 bottom
H7  35,20.5 180 bottom
HOLE1  20,107.5 0 top
HOLE2  20,3 0 top
Q1  20,61.75 0 top
Q2  20,56.75 0 top
R1  5.5,102.5 180 top
R2  5.5,98.5 0 top
R3  5.5,96.5 0 top
R4  21.5,77.5 270 top
R5  23.25,77.5 270 top
R6  29.5,65 0 top
R7  33,65 180 top
R8  36.5,65 180 top
R9  29.5,63 0 top
R10  33,63 180 top
R11  36.5,63 180 top
R12  17,61.75 270 top
R13  23,61.75 270 top
R14  29.5,61 180 top
R15  33,61 0 top
R16  36.5,61 0 top
R17  8.5,60 270 top
R18  10.5,60 90 top
R19  6,59.5 270 top
R20  17,56.75 270 top
R21  23,56.75 270 top
R22  5,56.5 180 top
R23  5,51.5 180 top
R24  16.5,49.75 270 top
R25  6,48.5 90 top
R26  8.5,48 90 top
R27  10.5,48 270 top
R28  29.5,46 180 top
R29  33,46 0 top
R30  36.5,46 0 top
R31  11,44 180 top
R32  29.5,44 0 top
R33  33,44 180 top
R34  36.5,44 180 top
R35  14.5,43 270 top
R36  16.25,43 270 top
R37  18,43 270 top
R38  19.75,43 270 top
R39  21.5,43 270 top
R40  23.25,43 270 top
R41  25,43 270 top
R42  29.5,42 0 top
R43  33,42 180 top
R44  36.5,42 180 top
R45  23.75,30.5 270 top
R46  2.5,26.25 180 top
R47  13.5,26.25 0 top
R48  2.5,24.5 180 top
R49  13.5,24.5 0 top
R50  2.5,22.75 0 top
R51  13.5,22.75 0 top
R52  2.5,21 180 top
R53  13.5,21 180 top
R54  29.25,7.5 90 top
U1  28.75,85.25 0 top
U2  9.5,83.5 0 top
U3  9,54 0 top
U4  29.5,53.5 180 top
U5  35.5,53.5 180 top
U6  20,49.75 0 top
U7  8,23 270 top
U8  27.25,20.5 90 top
U9  13,6 0 top
U10  30.25,3.5 180 top
U$1  [FIDUCIAL]  23.5,99.5 0 top
U$2  [LOGO-OSHW]  15,72 0 bottom
U$3  [FIDUCIAL]  2,34 0 top
U$4  [LOGO-OSH]  15,94 0 bottom
U$5  [LOGO-CC]  15,82 0 bottom
U$6  [FIDUCIAL]  37.5,2.5 0 top
U$7  [LOGO-REV]  32,105.5 0 bottom
U$8  [LOGO-SN]  15,21 0 bottom
U$9  [LOGO-TD]  15,53.5 0 bottom
U$10  [LOGO-PN]  36.5,83.5 270 bottom
U$11  [LOGO-QC]  29,83.5 270 bottom
X1  36.75,91 270 top
X2  4.5,70.5 180 top

### Tracks (layer width: path | path; a pad name or v marks a point on that pad's centre or on a via)
12V  (via drill 0.25)
  Top 0.25: v7.3,54 C32.2 4.81,55 3.5,55 3,55.5 2,55.5 v1.65,55.15 | C44.A 30,30.5 28.1,32.4 D1.C 25.5,32.4 25.14,32.03 R45.1 | R45.1 v23.75,31 | U9.3 15.3,4.55 v15.75,5 | U7.8 9.28,23.98 8.81,24.44 C47.2 8.81,27.69 8.5,28 v8.5,31.5 21.5,31.5 22.04,32.03 R45.1 | U3.8 7.33,56.92 v7.3,56.9
  Bottom 0.25: v23.75,31 23.75,13 v15.75,5 | v8.5,31.5 6,31.5 3.2,34.3 3.2,40.3 1.5,42 1.5,55 v1.65,55.15 | v7.3,54 v7.3,56.9
-10V  (via drill 0.25)
  Top 0.25: C55.2 28.14,4.81 28.35,4.6 U10.2 29.3,5.8 29.25,5.85 R54.1 28.06,6.69 v28,6.75 | R9.1 29.5,62.19 v29.5,62 | R10.1 33,62.19 v33,62 | R32.1 29.5,44.81 v29.5,45 | v33,45 33,44.81 R33.1 34.75,43.06 34.75,40.95 v34.3,40.5
  Bottom 0.25: v28,6.75 28,30.45 34.3,36.75 v34.3,40.5 | v29.5,45 v33,45 33.15,45.15 33.15,59.25 33.65,59.75 33.65,61.35 v33,62 | v29.5,62 v33,62 | v33,62 33.65,62.65 33.65,64.2 34.25,64.8 34.25,67.6 34.25,67.7 34.25,68.48 H2.4
-12V  (via drill 0.25)
  Top 0.25: C52.C 30.95,8.8 30.46,8.31 R54.2 28.29,8.31 28,8.6 D2.A 23.15,8.6 19,12.75 10.25,12.75 7.19,15.81 C50.1 7.19,22.02 | U7.4 7.19,22.02 | 7.19,22.02 7.19,23.71 5.9,25 5.9,26.65 7.25,28 v7.25,33.5 | v12,45.75 9.5,45.75 8.75,45 8.75,42.2 8.1,41.55 6,41.55 v5.75,41.3 | U3.4 10.57,51.08 v11.05,51.55 11.5,52 C33.1
  Bottom 0.25: v7.25,33.5 5.75,35 v5.75,41.3 | v12,45.75 10.9,46.85 10.9,51.4 v11.05,51.55
A3V3  (via drill 0.25)
  Top 0.25: C35.2 36.48,52.69 | U5.8 36.48,52.69 | 36.48,52.69 36.48,53.52 35.69,54.31 C34.2 v31.96,54.31 v31.95,54.3 25.7,54.3 23.45,52.05 v23.45,51.95 | U9.4 U9.2 | U9.4 15.15,8.9 15.25,9 C53.2 16.19,10.19 v16.25,10.25 | U9.4 9.15,8.9 9.05,8.8 C54.A | U2.13 11.75,76.15 12.4,75.5 13.75,75.5 14.31,74.94 C24.2 C25.2 | C25.2 14.31,69.61 13.5,68.8 C26.A | C16.2 28.02,78 27.71,78.31 C19.2 C18.2 | C16.2 28.69,76.69 28.95,76.42 C21.A 28.95,72.55 | C25.2 25.7,71.5 26.75,72.55 28.95,72.55 | U4.4 29.5,57.7 29.95,58.15 30.9,58.15 31.15,58.4 31.15,58.7 31.25,58.8 v31.25,60 31.25,65.48 H2.5 | 28.95,72.55 29.1,72.55 29.6,72.05 31.6,72.05 v31.95,71.7 | U1.8 29.07,79.5 | 29.07,79.5 29.07,79.08 28.69,78.69 C16.2 | U1.14 32.98,79.97 32.5,79.5 29.07,79.5
  Bottom 0.25: v16.25,10.25 21.75,15.75 21.75,32 24.7,34.95 24.7,41 23.6,42.1 23.6,51.8 v23.45,51.95 | H2.5 31.75,68.48 31.75,71.5 v31.95,71.7 | v31.95,54.3 32.65,55 32.65,58.6 v31.25,60
BLEND-CV  (via drill 0.25)
  Top 0.25: U4.7 27.55,57.86 C29.2 R14.2 27.9,61.79 27.9,65.55 28.2,65.85 30.9,65.85 31.75,66.7 31.75,70.3 31,71.05 29.2,71.05 28.7,71.55 27.15,71.55 26.1,70.5 17.35,70.5 17.05,70.2 16.3,70.2 v16.2,70.3 | U2.21 v14.1,81.75
  Bottom 0.25: v14.1,81.75 15.7,80.15 15.7,79.35 16.25,78.8 16.25,73.35 15.95,73.05 15.95,72.5 16.15,72.3 16.15,70.35 v16.2,70.3
BLEND-JACK  (via drill 0.25)
  Top 0.25: R6.1 29.5,64.19 v29.5,64
  Bottom 0.25: H4.1 36.8,38.51 36.8,40.3 36.05,41.05 35.4,41.05 34.8,41.65 33.8,41.65 33.65,41.5 27,41.5 25.6,42.9 25.6,49.35 27.85,51.6 27.85,52.2 27.7,52.35 27.7,55.9 27.15,56.45 27.15,63.15 27.85,63.85 29.35,63.85 v29.5,64
BLEND-POT  (via drill 0.25)
  Top 0.25: U2.23 v12.2,82.75
  Bottom 0.25: v12.2,82.75 10.65,81.2 10.65,73.7 9.9,72.95 9.9,41.2 10.8,40.3 10.8,38.51 H3.1
D3V3  (via drill 0.25)
  Top 0.25: U8.4 24.35,18.45 23.05,17.15 C51.A | U8.4 C49.2 | U8.4 U8.2 | C20.2 2.25,79.75 | U2.19 16.9,80.75 17.5,80.15 C17.2 18.74,78.31 20.36,76.69 R4.2 | R4.2 R5.2 24.15,77.59 24.15,79.1 | U2.48 5.75,91.5 | 5.75,91.5 6.75,92.5 C9.2 C3.2 10.69,97.19 11.25,97.75 C2.A | C2.A 13.7,96.2 14.15,95.75 15.75,95.75 16.19,95.31 C11.2 16.19,88.55 | 16.19,88.55 19.25,88.55 | 16.19,88.55 15.25,87.61 U2.32 | 21.62,50.56 U6.10 21.62,53.58 v23,54.95 R21.2 | U2.64 2.25,79.75 | 5.75,91.5 1.6,91.5 0.95,90.85 0.95,89.1 1.4,88.65 1.4,80.6 2.25,79.75 | 24.15,79.1 23.2,79.1 22.4,79.9 22.04,79.9 C14.2 20.86,80.44 19.25,82.05 19.25,88.55 | R13.2 v23,60 | U8.4 26.5,20.5 v26.5,21.15 | v17.6,47.85 20.31,50.56 21.62,50.56 | C36.2 21.62,50.56 | U6.16 17.73,51.38 v17.6,51.25 | R4.2 21.5,76.15 v21.9,75.75 | U1.1 24.52,80.08 24.15,79.7 24.15,79.1 | U1.27 25.18,90.67 26,91.5 C7.2 C6.2 23.19,92.69 22.45,91.95 C4.A 20.75,89 20.3,88.55 19.25,88.55 | R1.2 4.69,104.15 | 4.69,104.15 4.69,106.06 5.51,106.89 H5.1 | C2.A 13.7,102.15 11.7,104.15 4.69,104.15
  Bottom 0.25: v26.5,21.15 26.5,33.65 25.2,34.95 25.2,41.2 24.1,42.3 24.1,52.2 23.15,53.15 23.15,54.8 v23,54.95 23.15,55.1 23.15,58.05 22.85,58.35 22.85,58.8 23,58.95 v23,60 23.65,60.65 23.65,63.65 21.75,65.55 21.75,75.6 v21.9,75.75 | v17.6,51.25 17.75,51.1 17.75,48 v17.6,47.85
DENS-CV  (via drill 0.25)
  Top 0.25: R30.2 C40.2 37.31,48.89 35.83,50.38 U5.7 35.83,53.48 35.5,53.8 33.85,53.8 33.55,53.5 31.7,53.5 31.4,53.8 25.9,53.8 25.5,53.4 v25.5,53.2 | U2.17 16.2,79.75 v16.35,79.6 | v16.6,72.8 17.4,72.8 17.7,72.5 23.75,72.5 v23.9,72.65
  Bottom 0.25: v23.9,72.65 23.75,72.5 23.75,69.05 24.65,68.15 24.65,53.75 25.2,53.2 v25.5,53.2 | v16.35,79.6 16.75,79.2 16.75,72.95 v16.6,72.8
DENS-JACK  (via drill 0.25)
  Top 0.25: R44.1 36.5,42.81 v36.5,43 | v39.35,71.2 v39.35,65.8
  Bottom 0.25: H1.1 37.3,96.45 37.3,74.15 37.45,74 37.45,72.9 39.15,71.2 v39.35,71.2 | v36.5,43 37.15,43.65 37.15,60.05 39.2,62.1 39.2,65.65 v39.35,65.8
DENS-POT  (via drill 0.25)
  Top 0.25: R34.1 36.5,44.81 v36.5,45
  Bottom 0.25: H1.3 36.3,96.47 36.3,74.15 36.15,74 36.15,73.5 39.35,70.3 39.35,66.7 38.7,66.05 38.7,62.3 36.65,60.25 36.65,45.15 v36.5,45
FREEZE  (via drill 0.25)
  Top 0.25: R21.1 21.69,57.56 21.4,57.85 Q2.3 18.15,57.85 17.6,58.4 16.25,58.4 v16.05,58.2 | U2.59 10,82.25 11.85,80.4 v12.2,80.4
  Bottom 0.25: v16.05,58.2 16.75,58.9 16.75,67.8 14.2,70.35 14.2,75.25 14.5,75.55 14.5,77.1 13.3,78.3 13.3,79.35 13.45,79.5 13.45,80.1 13.1,80.45 12.25,80.45 v12.2,80.4
FREEZE-JACK  (via drill 0.25)
  Top 0.25: v1.3,55.85 1.45,56 3.25,56 3.75,55.5 10.5,55.5 12.56,57.56 R20.1
  Bottom 0.25: v1.3,55.85 1,55.55 1,40.69 H3.10
GND  (via drill 0.25)
  Top 0.25: U4.5 v28.85,57.45 | U4.3 v30.15,57.45 | U4.10 28.85,51.38 | U4.10 28.85,49.77 | U4.10 U4.11 | U4.11 29.5,51.38 | U4.11 29.5,49.77 | U4.11 U4.12 | U4.12 30.15,51.38 | U4.12 30.15,49.77 | U5.5 34.52,52.12 | U5.5 34.08,51.3 | U5.5 34.52,50.5 | 35.17,56.5 U5.3 U5.4 | U5.4 34.52,56.5 | U5.4 34.08,55.7 | 9.32,51.88 U3.3 9.32,50.27 | U3.5 9.97,57.73 | U3.5 9.97,56.12 | U3.5 10.43,56.92 | 4.62,80.25 U2.63 2.83,80.25 | 14.38,85.25 U2.28 16.12,85.25 | 14.38,84.25 U2.26 16.12,84.25 | 14.38,80.25 U2.18 16.12,80.25 | 11.25,78.62 U2.12 11.25,76.88 | 4.25,22.68 U7.3 5.9,22.68 | U6.8 22.27,47.6 | U6.8 22.27,45.98 | U6.8 22.73,46.83 | U6.13 19.68,51.83 | U7.5 10.1,22.02 | U7.5 11.72,22.02 | U7.5 10.93,21.57 | U2.60 4.75,81.75
  other vias: 13.5,28.93 16.45,84.75 4.55,70.5 13.15,43 16.45,52.15 35.15,53.1 35,56.9 38,55.45 31.85,52.7 30.6,51.75 29.15,51.75 25.9,51.95 30.3,49.1 22,56.7 22.1,55.1 15.1,72.5 15.2,70.8 14.8,78.5 13,81.85 11.7,79.25 15.4,75.7 6,109.85 9.75,109.85 2.25,109.6 0.75,106.6 0.75,103.35 0.75,100.35 0.75,97.35 0.75,94.85 6.75,91.35 5,89.85 2.5,88.35 0.75,88.35 5.75,87.35 2.5,84.35 2.25,82.1 0.75,84.85 3.25,78.6 6.25,80.1 9.75,79.1 7.25,79.1 8.5,81.35 8.25,83.85 11.25,87.85 13.75,84.85 10.75,85.35 13,95.85 13.25,93.6 13.75,91.35 15.25,90.5 15.5,92.1 15.5,96.6 17.25,109.6 13.5,109.85 17,105.6 20,103.85 22.5,105.1 22.75,109.6 17.25,99.35 25.75,109.75 34.5,109.75 30.5,109.75 39.25,101.25 34.5,101.25 26,100.5 19.5,97.35 22.5,97.35 25,97.25 17,91.1 18,95.1 39,95.6 39.25,98.5 34.25,96 39.25,74 30.25,76.5 32.75,76 32.75,73 34.75,74.5 28.25,76 27,73.25 24.25,75 25.25,73 26.25,75.75 19.5,78.75 5.75,76.25 3,74.5 3,72.5 4.75,74.5 6.5,74.5 8.5,72.25 8.25,68.5 2,68 5.75,67.5 4.5,65 4.5,63 7,61.75 2.25,61.5 5,59.5 5,57.75 7.25,57.75 2.5,58 8.5,54.25 3.75,53 5,50.25 7,50.75 5,48.5 4.75,46 8,45.75 4.5,42.75 7.75,42.5 0.75,38.25 0.75,35.75 4.5,35.5 9,35.75 7.25,34.5 8,32.25 3.5,31.5 0.75,32.5 0.75,29 2.5,29 2.5,27.25 4.25,27.25 4.25,25.5 6.25,23.75 8,24 7.5,27 0.75,25.5 0.75,22 1,19.5 5.25,20.75 6.5,16.25 8,16.25 9.25,30.75 9.75,27.75 9.5,24.75 11.5,27.25 12.25,30.5 16.5,30.75 15.5,28.5 16.5,32.25 12.25,32.5 12.25,34.25 15.75,34.5 20.5,35.25 23.25,34.75 20.75,32.25 20.75,30.75 25,33.5 22.75,30.75 25.25,30.5 22.75,27.75 25.25,27 20.25,26.5 20.25,22.75 16.25,22.75 10.75,20.5 22.75,23 25,23.25 27.25,25.75 27.25,31 27.25,22 29.75,25 31.75,28 29.75,16 26.75,19.25 26.25,14.75 22.75,10.5 26.75,10.5 21.75,13.25 17.5,14 17.5,18.25 20.25,18.75 15,16 20.25,16 19,10.5 21.25,9 16.25,11.75 10.5,12 10.5,13.5 3.75,3.25 7.25,3.25 5.5,6 10.75,5.5 10.75,1 14,1 17,1 7.25,1 3.5,1 1.5,1.75 1,4.25 1,7.75 0.75,12 1,16 7.25,9.75 7.25,7.5 10.5,8 14.5,6 16.75,7.5 13,10.5 4.5,13.75 23,1 18.25,6 22.25,5.75 26.5,7 28.75,2.5 26.5,1 25.75,3.5 31,6.75 32,2.5 30.25,1 34.75,1 39.25,3.75 39,7 39.25,10.5 36.25,12.25 36.25,8.75 33.75,10.5 32.75,4.75 30.75,12.5 36.5,28.75 36.5,32.25 33.75,30.5 39,35.5 34.75,35.75 31,32 27.5,34 30.75,34.5 36,5 4,17.5 3.75,8.75 26,39 23.75,39.25 23.5,40.75 11,42.25 11.25,45 12.5,52.25 11.75,49.5 15,50.25 15,46.25 13,54.5 14.5,56.25 11.75,58.5 15,58.25 12.5,60.5 15.5,63 16,59.75 13,65.25 15,66 22,61.75 22,59.75 22,63.25 22.5,51.5 22.25,49 27.25,47.25 27.25,43.25 31.25,47 31.25,43 29.5,47 35,47 35,45 32.25,50 35,49.25 39.25,41.25 39,45 38.75,49 39.25,52 39.25,54.25 39.25,57.5 39.25,60.25 36.5,62 38,64 33,60 29.5,60 29.75,73 34,71.75 27.25,45.25 22.25,43 20.5,43 13.75,19.75 11.25,17 39.25,15.25 39.25,20 39.25,25 39.25,30.5 26.75,95.5 22.5,93.75 20,89.5 24,91.25 23.5,89 21,88 25.5,87 27.75,92.25 31.5,92.25 35,94.25 39,91.5 39,87.75 39,82.75 39.25,78.25 35,77.5 31.5,78.75 31,83 33.5,84.75 35,81.5 20.25,83.25 34.75,86.25 34.25,89.5 34.75,92 22.5,86.5 0.75,91.85 12.25,99.5 12.25,102.25 13,104.5 5.75,105.25 5.5,101.5 5.5,99.5 5.5,97.5 5.5,95.5 7.75,97.75 3.25,97.5 8,103.25 7.75,101.5 8,99.5 3.25,101.75 3.75,105.25 5,107.5 7.25,93.25 4.5,92.25 15.5,99.25 18.5,99.25 16.5,102.25 21.75,101.25 29.25,101.25 39.25,104.35 39.25,106.85 34.5,106 27.75,106.25 38.5,109
  pour Top (isolate 0.25): 0,110.5 40,110.5 40,0 0,0
  pour Bottom (isolate 0.25): 0,110.5 40,110.5 40,0 0,0
I2C-SCL  (via drill 0.25)
  Top 0.25: U2.29 16.5,85.75 18.25,84 18.25,81.55 20.5,79.3 v20.5,79.05 20.5,78.5 20.69,78.31 R4.1 | U1.24 27.12,87.62 v26.75,87.25
  Bottom 0.25: v20.5,79.05 20.5,79.4 21,79.9 21.5,79.9 21.85,80.25 21.85,81.85 26.75,86.75 v26.75,87.25
I2C-SDA  (via drill 0.25)
  Top 0.25: U2.30 16.75,86.25 18.75,84.25 18.75,81.8 v21.3,79.25 21.45,79.4 22.16,79.4 R5.1 | U1.23 27.77,87.28 v27.5,87
  Bottom 0.25: v21.3,79.25 21.55,79.25 22.35,80.05 22.35,81.65 27.5,86.8 v27.5,87
I2S-LRCK  (via drill 0.25)
  Top 0.25: U2.33 13.25,88.35 v13,88.1 | v21.25,84.25 22,85 25.5,85 27.12,83.38 U1.5 27.12,80.38 27.5,80 28,80 28.43,80.42 U1.7
  Bottom 0.25: v13,88.1 17.8,88.1 21.25,84.65 v21.25,84.25
I2S-SCK  (via drill 0.25)
  Top 0.25: U2.34 12.75,90.05 13.1,90.4 v13.3,90.4 | v22.75,83.75 23,84 25,84 25.82,83.17 U1.3
  Bottom 0.25: v13.3,90.4 13.3,90.15 14.35,89.1 18.2,89.1 22.75,84.55 v22.75,83.75
I2S-SIN  (via drill 0.25)
  Top 0.25: U2.35 12.25,88.2 v12.15,88.1 | v20.5,84.5 21.5,85.5 25.75,85.5 27.77,83.47 U1.6
  Bottom 0.25: v12.15,88.1 12.15,88 12.7,87.45 13.25,87.45 13.4,87.6 17.6,87.6 20.5,84.7 v20.5,84.5
I2S-SOUT  (via drill 0.25)
  Top 0.25: U2.36 11.75,90.05 11.95,90.25 12.2,90.25 12.75,90.8 v12.75,91 | v22,84 22.5,84.5 25.25,84.5 26.48,83.28 U1.4
  Bottom 0.25: v12.75,91 12.65,90.9 12.65,90.1 14.15,88.6 18,88.6 22,84.6 v22,84
IN-L  (via drill 0.25)
  Top 0.25: C43.A v16.6,33.3 | U1.20 29.73,87.22 29.25,86.75 v28.25,86.75
  Bottom 0.25: v16.6,33.3 16.75,33.45 16.75,44.95 18.25,46.45 18.25,68.3 17.65,68.9 17.65,69.4 19.25,71 19.25,76.85 20.85,78.45 21.45,78.45 22.85,79.85 22.85,81.45 28.15,86.75 v28.25,86.75
IN-L-JACK  (via drill 0.25)
  Top 0.25: R53.1 13.5,21.81 v13.5,21.88 | v30.15,95.8 30.35,95.6 31.3,95.6 v31.45,95.75
  Bottom 0.25: H1.4 34.83,99.77 33.55,101.05 32.5,101.05 31.22,99.77 H1.8 29.2,98.51 29.2,96.7 30.1,95.8 v30.15,95.8 | v13.5,21.88 19.75,28.12 19.75,43.5 21.25,45 21.25,76.05 21.65,76.45 22.25,76.45 24.85,79.05 24.85,80.65 28.8,84.6 29.25,84.6 30.45,85.8 30.45,94.45 31.45,95.45 v31.45,95.75
IN-L-POT-A  (via drill 0.25)
  Top 0.25: R51.2 13.5,23.56 v13.5,23.62
  Bottom 0.25: v13.5,23.62 14.53,23.62 19.25,28.35 19.25,43.75 20.75,45.25 20.75,76.25 21.45,76.95 22.05,76.95 24.35,79.25 24.35,80.85 28.6,85.1 29.05,85.1 29.95,86 29.95,94.65 30.8,95.5 30.8,96.89 H1.7
IN-L-POT-B  (via drill 0.25)
  Top 0.25: U7.7 11.78,23.32 11.97,23.52 11.97,23.79 R49.1 13.5,25.31 v13.5,25.38
  Bottom 0.25: v13.5,25.38 13.68,25.55 15.75,25.55 18.75,28.55 18.75,44 20.25,45.5 20.25,76.45 21.25,77.45 21.85,77.45 23.85,79.45 23.85,81.05 28.4,85.6 28.85,85.6 29.45,86.2 29.45,95.7 H1.9
IN-R  (via drill 0.25)
  Top 0.25: C42.A 5.25,33.75 6.75,35.25 v8.25,35.25 | v9.25,62.3 9.7,61.85 13.25,61.85 16.9,65.5 21.85,65.5 22.15,65.2 22.8,65.2 v23.15,65.55 | U1.19 30.38,87.78 v31.1,87.05
  Bottom 0.25: v8.25,35.25 8.25,40.3 9.4,41.45 9.4,62.15 v9.25,62.3 | v23.15,65.55 23.65,66.05 23.65,66.65 23.25,67.05 23.25,74.75 23.55,75.05 23.55,75.65 26.35,78.45 26.35,80.05 29.4,83.1 29.85,83.1 30.9,84.15 31.5,84.15 32.4,85.05 32.4,85.55 31.1,86.85 v31.1,87.05
IN-R-JACK  (via drill 0.25)
  Top 0.25: R50.1 2.5,23.56 v2.5,23.65 | v28.7,94.6 31.25,94.6 v31.4,94.45
  Bottom 0.25: H1.6 31.75,98.52 31.75,96.4 32.1,96.05 32.1,95.4 31.4,94.7 v31.4,94.45 | v2.5,23.65 3.75,22.4 8.9,22.4 13.05,26.55 15.3,26.55 17.75,29 17.75,44.5 19.25,46 19.25,69.05 18.95,69.35 18.95,70 19.75,70.8 19.75,76.65 21.05,77.95 21.65,77.95 23.35,79.65 23.35,81.25 28.2,86.1 28.65,86.1 28.95,86.4 28.95,94.35 v28.7,94.6
IN-R-POT-A  (via drill 0.25)
  Top 0.25: R52.2 2.5,21.81 v2.5,21.9 | v19.6,69.65 19.75,69.5 25.85,69.5 27.4,71.05 28.45,71.05 29.73,69.77 H2.8
  Bottom 0.25: v2.5,21.9 9.1,21.9 13.25,26.05 15.5,26.05 18.25,28.8 18.25,44.25 19.75,45.75 19.75,69.5 v19.6,69.65
IN-R-POT-B  (via drill 0.25)
  Top 0.25: U7.1 3.83,23.98 R48.1 2.5,25.31 v2.5,25.38 | H2.10 27.15,69 18.45,69 v18.3,69.15
  Bottom 0.25: v2.5,25.38 4.97,22.9 8.7,22.9 12.85,27.05 15.1,27.05 17.25,29.2 17.25,44.75 18.75,46.25 18.75,68.7 v18.3,69.15
JTCK/SWCLK  (via drill 0.25)
  Top 0.25: U2.49 4.9,87.25 5.6,86.55 v5.6,86.4
  Bottom 0.25: v5.6,86.4 5.85,86.4 9.55,90.1 9.55,104.3 H5.4
JTDI  (via drill 0.25)
  Top 0.25: U2.50 4.65,86.75 4.9,86.5 v4.9,86
  Bottom 0.25: v4.9,86 4.9,85.35 5.3,84.95 5.9,84.95 6.25,85.3 6.25,85.4 10.55,89.7 10.55,105.39 H5.8
JTDO/SWO  (via drill 0.25)
  Top 0.25: U2.55 4.6,84.25 4.9,84.55 4.9,84.9 v5.6,85.6
  Bottom 0.25: v5.6,85.6 5.75,85.6 10.05,89.9 10.05,105.06 H5.6
JTMS/SWDIO  (via drill 0.25)
  Top 0.25: U2.46 6.75,90.3 7.95,91.5 8.7,91.5 v8.9,91.3
  Bottom 0.25: H5.2 9.05,103.53 9.05,91.45 v8.9,91.3
LED-1-GRN
  Top 0.25: H3.5 8.25,38.48 8.25,40.3 9,41.05 10.85,41.05 11.35,41.55 12.8,41.55 14.35,40 19.95,40 20.25,40.3 21.15,40.3 21.45,40 24.3,40 25,40.7 R41.2
LED-1-RED  (via drill 0.25)
  Top 0.25: H3.4 10.27,39.77 11.55,41.05 12.6,41.05 14.15,39.5 20.15,39.5 20.45,39.8 20.95,39.8 21.25,39.5 22.15,39.5 v22.3,39.35 | R40.2 22.3,41.24 v22.3,41.2
  Bottom 0.25: v22.3,39.35 v22.3,41.2
LED-2-GRN  (via drill 0.25)
  Top 0.25: H3.3 10.81,38.5 21.35,38.5 v21.5,38.65 | R39.2 v21.5,41.2
  Bottom 0.25: v21.5,41.2 v21.5,38.65
LED-2-RED  (via drill 0.25)
  Top 0.25: H3.2 12.85,39 20.55,39 v20.7,39.15 | R38.2 20.7,41.24 v20.7,41.2
  Bottom 0.25: v20.7,39.15 v20.7,41.2
LED-3-GRN  (via drill 0.25)
  Top 0.25: H4.10 26.15,38 16.25,38 v16.1,37.85 | R37.2 18,40.95 17.55,40.5 16.25,40.5 v16.1,40.65
  Bottom 0.25: v16.1,37.85 v16.1,40.65
LED-3-RED  (via drill 0.25)
  Top 0.25: H4.7 29.18,35.95 27.4,35.95 26.35,37 16.85,37 16.55,36.7 15.6,36.7 15.15,37.15 v14.95,37.15 | R36.2 15.46,41.4 v15.4,41.4
  Bottom 0.25: v14.95,37.15 15.4,37.6 v15.4,41.4
LED-4-GRN  (via drill 0.25)
  Top 0.25: H4.8 29.19,38.5 27.35,38.5 26.35,37.5 16.65,37.5 16.35,37.2 15.8,37.2 15.15,37.85 v14.6,37.85 | R35.2 14.5,40.75 v14.6,40.65
  Bottom 0.25: v14.6,37.85 v14.6,40.65
LED-4-RED  (via drill 0.25)
  Top 0.25: R24.2 v16.5,46.65 | H4.5 32.28,37.23 31,35.95 29.9,35.95 29.4,35.45 27.2,35.45 26.15,36.5 17.05,36.5 16.75,36.2 15.4,36.2 15.1,36.5 14.65,36.5 14.15,37 v14.15,37.2
  Bottom 0.25: v14.15,37.2 13.95,37.4 13.95,40.9 16.25,43.2 16.25,46.4 v16.5,46.65
LED-DATA  (via drill 0.25)
  Top 0.25: U2.57 4.75,83.25 v4.9,83.4 | U6.14 19.02,53.38 18.85,53.55 15,53.55 v13.1,55.45 | v8.95,73.6 9.4,73.6 9.9,73.1 9.9,72.4 10.25,72.05 v11.05,72.05
  Bottom 0.25: v4.9,83.4 4.9,82 4.25,81.35 4.25,80.8 4.4,80.65 4.4,78.85 8.85,74.4 8.85,73.7 v8.95,73.6 | v11.05,72.05 10.9,71.9 10.9,57.65 v13.1,55.45
LED-EN  (via drill 0.25)
  Top 0.25: U2.24 16.25,83.25 v16.4,83.1 | U6.12 20.32,53.38 19.65,54.05 15.45,54.05 v14.8,54.7
  Bottom 0.25: v16.4,83.1 16.5,83.1 18.25,81.35 18.25,71.4 16.65,69.8 16.65,68.6 17.25,68 17.25,56.95 15.6,55.3 15.4,55.3 v14.8,54.7
LED-FREEZE
  Top 0.25: H3.7 5.75,38.52 5.75,40.35 6.45,41.05 8.3,41.05 8.8,41.55 9.45,41.55 10.19,42.29 R31.2
LED-SCK  (via drill 0.25)
  Top 0.25: U2.25 v16.9,83.75 | U6.11 20.98,53.48 19.9,54.55 15.85,54.55 v15.7,54.7
  Bottom 0.25: v16.9,83.75 17.05,83.6 17.05,83.25 18.75,81.55 18.75,71.2 17.15,69.6 17.15,68.75 17.75,68.15 17.75,56.75 v15.7,54.7
N$1
  Top 0.25: R24.1 17.86,50.56 18.38,51.08 U6.15
N$2
  Top 0.25: R45.2 23.75,27.5 23.05,26.8 C48.A 25.75,25 27.95,22.8 U8.3
N$3
  Top 0.25: U7.2 3.88,23.32 R50.2 R52.1
N$4
  Top 0.25: U7.6 11.85,22.68 11.93,22.75 R51.1 R53.2
N$5
  Top 0.25: U4.6 28.2,57.75 28.55,58.1 29.2,58.1 29.75,58.65 29.96,58.65 C29.1 R14.1 R9.2 R6.2
N$6
  Top 0.25: U6.1 17.73,45.73 17.4,45.4 15,45.4 14.5,44.9 R35.1
N$7
  Top 0.25: U2.31 14.5,86.75 14.25,87 14.25,87.5 14.5,87.75 C5.2
N$8
  Top 0.25: U2.47 6.25,88.5 6,88.25 5.5,88.25 4.75,89 4,89 3.81,89.19 C10.2
N$9
  Top 0.25: R36.1 16.25,44.6 16.55,44.9 17.6,44.9 18.38,45.67 U6.2
N$10
  Top 0.25: R12.2 17.86,60.94 18.15,60.65 Q1.1
N$11
  Top 0.25: X2.2 2.45,70.75 3.81,72.11 C22.1 3.81,74.86 4.45,75.5 6.95,75.5 7.75,76.3 U2.5
N$12
  Top 0.25: X2.1 6.55,71.95 7.31,72.71 C23.1 7.31,75.11 8.25,76.05 U2.6
N$13
  Top 0.25: U5.2 35.83,57.23 35.69,57.36 C31.1 R16.1 R11.2 R8.2
N$14
  Top 0.25: U5.6 35.17,50.12 35.69,49.61 C40.1 R30.1 R34.2 R44.2
N$15
  Top 0.25: U4.9 28.2,49.25 28.57,48.88 29.43,48.88 C38.1 R28.1 R32.2 R42.2
N$16
  Top 0.25: U4.2 30.8,57.3 31.65,58.15 31.65,58.46 C30.1 R15.1 R10.2 R7.2
N$17
  Top 0.25: U4.13 30.8,49.75 31.65,48.9 31.65,48.54 C39.1 R29.1 R33.2 R43.2
N$18
  Top 0.25: C27.C 6.8,64 8.5,62.3 R17.1 R18.2
N$19
  Top 0.25: R49.2 R47.2 C46.2 14.31,29.19 13.8,29.7 C43.C
N$20
  Top 0.25: R27.2 R26.1 7.69,47.19 6.3,45.8 C41.C
N$21
  Top 0.25: R20.2 17.86,55.94 18.15,55.65 Q2.1
N$22
  Top 0.25: U1.25 26.48,90.47 27,91 34.5,91 35.94,89.56 35.94,88.95 | C12.2 35.94,88.95 | X1.2 35.94,88.95
N$23
  Top 0.25: U1.26 25.82,90.58 26.75,91.5 32.56,91.5 C8.2 36.7,93 X1.1
N$24
  Top 0.25: U3.6 9.32,58.37 R17.2 7.81,59.19 6.69,60.31 R19.1 C28.1
N$25
  Top 0.25: U3.7 8.68,58.12 8.4,58.4 7.9,58.4 7.61,58.69 R19.2 | R19.2 6,57.75 5.81,57.56 R22.1 | C28.2 R19.2
N$26
  Top 0.25: U3.2 8.68,49.62 8.5,49.45 R26.2 7.81,48.81 6.69,47.69 R25.1 C37.1
N$27
  Top 0.25: U1.16 32.33,87.17 34.5,85 C13.2 36.75,84.19 C15.A
N$28
  Top 0.25: R37.1 18,44.6 19.02,45.62 U6.3
N$29
  Top 0.25: R25.2 C37.2 | R25.2 7.61,49.31 8.03,49.73 U3.1 | R25.2 6,50.25 5.81,50.44 R23.1
N$30
  Top 0.25: U6.4 19.68,45.23 19.75,45.15 R38.1
N$31
  Top 0.25: U6.5 20.32,45.62 21.5,44.45 R39.1
N$32
  Top 0.25: U6.6 20.98,45.67 21.75,44.9 22.95,44.9 23.25,44.6 R40.1
N$33
  Top 0.25: U6.7 21.62,45.73 21.95,45.4 24.45,45.4 25,44.85 R41.1
N$35
  Top 0.25: R48.2 R46.2 C45.2 1.69,29.19 2.2,29.7 C42.C
N$37  (via drill 0.25)
  Top 0.25: U2.62 4.6,80.75 v4.9,81.05 | R31.1 v11.81,43.01 v11.8,43 | v9.5,74.2 10.55,73.15 v10.55,72.7
  Bottom 0.25: v11.8,43 10.4,44.4 10.4,72.55 v10.55,72.7 | v4.9,81.05 4.9,79.05 9.5,74.45 v9.5,74.2
N$100
  Top 0.25: H7.2 H7.1 31.67,15.42 28.65,12.4 D2.C
N$101
  Top 0.25: H7.10 H7.9 31.67,25.58 28.65,28.6 D1.A
OUT-L  (via drill 0.25)
  Top 0.25: C27.A 2.7,65.4 3.1,65.8 8.1,65.8 8.8,65.1 8.8,63.7 10.15,62.35 13.05,62.35 16.7,66 22.25,66 v22.4,65.85 | v30.85,85.3 31.68,84.47 U1.12
  Bottom 0.25: v22.4,65.85 22.25,66 22.25,75.15 22.55,75.45 22.55,76.05 25.35,78.85 25.35,80.45 29,84.1 29.45,84.1 30.65,85.3 v30.85,85.3
OUT-L-JACK  (via drill 0.25)
  Top 0.25: v0.65,56.5 R22.2
  Bottom 0.25: v0.65,56.5 0.5,56.35 0.5,39.4 1.92,37.98 H3.9
OUT-R  (via drill 0.25)
  Top 0.25: C41.A 2.7,44.9 v3.15,45.35 | v1.7,66.3 8.3,66.3 9.3,65.3 9.3,63.9 10.35,62.85 12.85,62.85 16.5,66.5 22.85,66.5 v23,66.35 | U1.13 32.33,84.72 v31.75,85.3
  Bottom 0.25: v3.15,45.35 3,45.5 3,54.15 3.3,54.45 3.3,55.8 2.95,56.15 2.95,56.55 1.5,58 1.5,66.1 v1.7,66.3 | v23,66.35 22.75,66.6 22.75,74.95 23.05,75.25 23.05,75.85 25.85,78.65 25.85,80.25 29.2,83.6 29.65,83.6 30.7,84.65 31.25,84.65 31.75,85.15 v31.75,85.3
OUT-R-JACK  (via drill 0.25)
  Top 0.25: H4.3 34.83,37.23 33.55,35.95 31.7,35.95 31.2,35.45 30.1,35.45 29.6,34.95 27,34.95 25.95,36 17.25,36 16.95,35.7 15.2,35.7 14.9,36 14.25,36 v13.9,36.35 | R23.2 4.19,52.44 4.5,52.75 9.6,52.75 10.85,54 12.3,54 v13.45,52.85
  Bottom 0.25: v13.9,36.35 13.45,36.8 13.45,41.1 15.75,43.4 15.75,50.55 v13.45,52.85
PITCH-CV  (via drill 0.25)
  Top 0.25: R15.2 C30.2 32.91,58.1 32.35,58.1 31.45,57.2 U4.1 31.45,55.55 31.2,55.3 25.95,55.3 v25.8,55.45 | U2.20 16.25,81.25 v16.4,81.4 | v17.1,72.15 17.25,72 25.05,72 v25.2,72.15
  Bottom 0.25: v25.2,72.15 25.05,72.15 24.75,71.85 24.75,69.45 25.65,68.55 25.65,55.6 v25.8,55.45 | v16.4,81.4 16.8,81.4 17.25,80.95 17.25,72.3 v17.1,72.15
PITCH-JACK  (via drill 0.25)
  Top 0.25: R7.1 33,64.19 v33,64
  Bottom 0.25: H4.2 36.3,41.55 35.6,41.55 35,42.15 33.6,42.15 33.45,42 27.2,42 26.1,43.1 26.1,49.15 28.35,51.4 28.35,52.4 28.2,52.55 28.2,56.1 27.65,56.65 27.65,62.95 28.05,63.35 32.35,63.35 v33,64
PITCH-POT  (via drill 0.25)
  Top 0.25: U2.9 9.75,75.6 10.4,74.95 v11.3,74.95 | v23.5,58.6 22.45,58.6 22.1,58.95 12.85,58.95 v12.75,59.05
  Bottom 0.25: v11.3,74.95 11.15,74.8 11.15,72.85 11.7,72.3 11.7,71.75 11.4,71.45 11.4,60.4 v12.75,59.05 | H4.9 27.92,37.98 26.65,39.25 26.65,40.45 24.6,42.5 24.6,52.4 23.65,53.35 23.65,58.45 v23.5,58.6
POS-CV  (via drill 0.25)
  Top 0.25: R16.2 C31.2 37.31,57.81 36.48,56.98 U5.1 36.48,54.98 36.3,54.8 33.9,54.8 33.6,55.1 31.7,55.1 31.4,54.8 v25.3,54.8 | U2.16 13.7,77.75 14,77.45 14,75.95 16.5,73.45 16.9,73.45 17.05,73.3 17.65,73.3 17.95,73 23.3,73 23.75,73.45 v23.9,73.45
  Bottom 0.25: v23.9,73.45 24.05,73.45 24.55,72.95 24.55,72.35 24.25,72.05 24.25,69.25 25.15,68.35 25.15,54.95 v25.3,54.8
POS-JACK  (via drill 0.25)
  Top 0.25: R8.1 37.31,66.19 36.8,66.7 v36.8,73.75
  Bottom 0.25: H1.2 36.8,98.49 v36.8,73.75
POS-POT  (via drill 0.25)
  Top 0.25: v28.8,95.4 29.1,95.1 v37.95,95.1 | R11.1 36.5,63.81 36.5,65.6 36.15,65.95 35,65.95 34.25,66.7 34.25,70.3 36.3,72.35 36.3,73.35 36.15,73.5 36.15,74.05 36.55,74.45 v37.95,74.45
  Bottom 0.25: H1.10 27.92,99.07 26.65,97.8 26.65,96.7 27.4,95.95 28.45,95.95 28.8,95.6 v28.8,95.4 | v37.95,95.1 37.8,94.95 37.8,74.6 v37.95,74.45
RESET  (via drill 0.25)
  Top 0.25: U2.7 v8.75,78.9 | C1.2 R1.1 v11.2,102.5
  Bottom 0.25: v8.75,78.9 6.75,80.9 6.75,85.2 11.05,89.5 11.05,102.35 v11.2,102.5 11.05,102.65 11.05,104.62 H5.10
RX
  Top 0.25: R3.1 3.72,96.5 3.45,96.23 H6.2
RX1  (via drill 0.25)
  Top 0.25: U2.43 v8.25,90.85 | R3.2 v8.4,96.5
  Bottom 0.25: v8.4,96.5 8.55,96.35 8.55,91.85 8.25,91.55 v8.25,90.85
SIZE-CV  (via drill 0.25)
  Top 0.25: R28.2 C38.2 27.55,49.14 U4.8 27.55,51.55 v27.2,51.9 | U2.15 12.75,77 13.15,76.6 v13.35,76.6 | v15.6,67.35 15.75,67.5 23.45,67.5 23.75,67.2 26.15,67.2 v26.45,66.9
  Bottom 0.25: v27.2,51.9 27.2,55.7 26.65,56.25 26.65,65.5 26.95,65.8 26.95,66.4 v26.45,66.9 | v13.35,76.6 13.35,75.9 13.2,75.75 13.2,69.95 15.6,67.55 v15.6,67.35
SIZE-JACK  (via drill 0.25)
  Top 0.25: R42.1 29.5,42.81 v29.5,43.05
  Bottom 0.25: v29.5,43.05 30.8,44.35 33.3,44.35 33.65,44.7 33.65,59.05 34.15,59.55 34.15,64 36.8,66.65 36.8,68.49 H2.2
SIZE-POT  (via drill 0.25)
  Top 0.25: U2.8 9.25,75.4 10.35,74.3 v11.8,74.3 | v12.85,68.15 14.55,68.15 14.9,68.5 29.19,68.5 H2.7
  Bottom 0.25: v11.8,74.3 11.65,74.15 11.65,73.05 12.2,72.5 12.2,69.55 12.85,68.9 v12.85,68.15
SW-FREEZE  (via drill 0.25)
  Top 0.25: U2.61 v2.6,81.25
  Bottom 0.25: v2.6,81.25 1,79.65 1,57.8 2.45,56.35 2.45,55.95 2.8,55.6 2.8,54.65 2.5,54.35 2.5,42.45 3,41.95 6.05,41.95 6.4,41.6 6.4,40.37 H3.6
SW-MEM  (via drill 0.25)
  Top 0.25: U2.51 2.75,86.25 v2.6,86.4 | v9.25,67 12.6,67 13.25,67.65 14.75,67.65 15.1,68 23.85,68 v24,67.85
  Bottom 0.25: v2.6,86.4 3.6,86.4 4.4,85.6 4.4,85.15 5.55,84 5.55,80.75 5.4,80.6 5.4,79.25 10.15,74.5 10.15,73.9 9.4,73.15 9.4,67.15 v9.25,67 | H4.4 35.54,40.21 34.6,41.15 34,41.15 33.85,41 26.8,41 25.1,42.7 25.1,52.6 24.15,53.55 24.15,67.7 v24,67.85
SW-MODE  (via drill 0.25)
  Top 0.25: U2.52 2.75,85.75 v2.6,85.6
  Bottom 0.25: v2.6,85.6 0.5,83.5 0.5,57.6 1.95,56.15 1.95,55.75 2.3,55.4 2.3,54.85 2,54.55 2,42.23 H3.8
TEXT-CV  (via drill 0.25)
  Top 0.25: R29.2 C39.2 32.91,48.9 32.4,48.9 31.45,49.85 U4.14 31.45,52 30.9,52.55 26.9,52.55 26.55,52.2 26.55,51.45 v26.65,51.35 | U2.14 12.25,76.55 v12.65,76.15 | v14.9,67.05 15.25,66.7 15.9,66.7 16.2,67 23.25,67 23.55,66.7 25.7,66.7 v26.3,66.1
  Bottom 0.25: v26.3,66.1 26.15,65.95 26.15,56.05 26.7,55.5 26.7,52.35 26.55,52.2 26.55,51.45 v26.65,51.35 | v12.65,76.15 12.7,76.1 12.7,69.75 14.9,67.55 v14.9,67.05
TEXT-JACK  (via drill 0.25)
  Top 0.25: R43.1 33,42.81 v33,43.05
  Bottom 0.25: v33,43.05 33,43.35 34.15,44.5 34.15,58.85 34.65,59.35 34.65,63.8 H2.1
TEXT-POT  (via drill 0.25)
  Top 0.25: U2.22 v16.4,82.25 | v16.8,70.85 16.95,71 25.9,71 26.95,72.05 28.9,72.05 29.4,71.55 31.2,71.55 31.7,71.05 34.3,71.05 35.65,72.4 v35.65,73.05
  Bottom 0.25: H2.3 35.54,67.94 36.8,69.2 36.8,72.15 35.9,73.05 v35.65,73.05 | v16.4,82.25 16.65,82.25 17.75,81.15 17.75,71.6 17,70.85 v16.8,70.85
TRIG  (via drill 0.25)
  Top 0.25: R13.1 21.74,62.56 21.45,62.85 Q1.3 19,62.85 17.9,61.75 v16.1,61.75 | U2.58 10.2,82.75 11.9,81.05 12.5,81.05 12.85,80.7 12.85,79.85 v12.8,79.8
  Bottom 0.25: v16.1,61.75 16.25,61.9 16.25,67.6 13.7,70.15 13.7,75.5 14,75.8 14,76.9 12.8,78.1 v12.8,79.8
TRIG-JACK
  Top 0.25: R12.1 17.96,62.56 19.35,63.95 25.6,63.95 27.92,66.27 H2.9
TX
  Top 0.25: R2.1 3.72,98.5 3.45,98.77 H6.1
TX1  (via drill 0.25)
  Top 0.25: U2.42 8.75,90.25 v8.9,90.4 | R2.2 v8.4,98.5
  Bottom 0.25: v8.9,90.4 8.7,90.2 7.95,90.2 7.6,90.55 7.6,91.55 8.05,92 8.05,95.99 7.79,96.25 7.79,96.75 8.55,97.51 8.55,98.35 v8.4,98.5

### Text on the board
tPlace: TD-UCSE-D-MB / 2019-12-18 | TX | RX
bPlace: SWD/JTAG | TX | RX | Board derived from / work by Émilie Gillet of / Mutable Instruments | POWER